# Altium project VM03_hv6.PrjPcb (part 1 of 2)
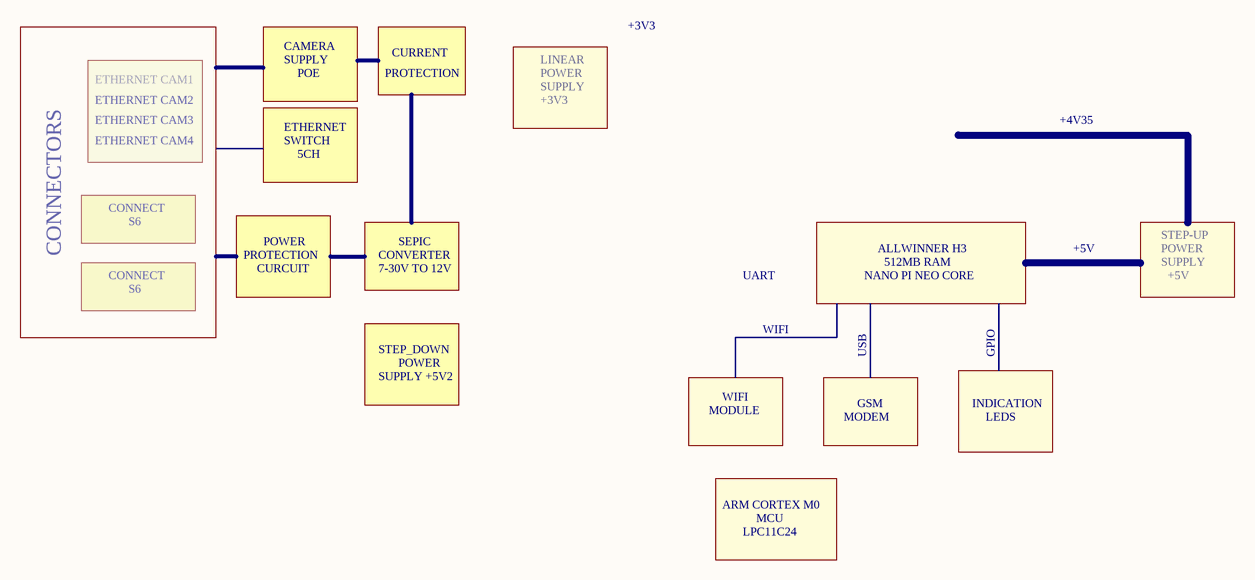
[diagram p0: [2]-BLOCK_DIAGRAM.SchDoc]
19 sheets, 346 parts. Net scope: flat (ports and power ports of the same name join across sheets).
Board file: VM03_hv6.PcbDoc
Sheets:
  [2]-BLOCK_DIAGRAM.SchDoc
  [3]-MCU_MAIN.SchDoc
  [4]-MCU_POWER.SchDoc
  [5]-MCU_CONNECTORS.SchDoc
  [6]-H3_MAIN.SchDoc
  [7]-H3_POWER.SchDoc
  [8]-MODEM_MAIN.SchDoc
  [9]-MODEM_POWER.SchDoc
  [10]-MODEM_CONNECTORS.SchDoc
  [11]-MAIN_POWER.SchDoc
  [12]-CAMERA_POWER.SchDoc
  [13]-BACKUP_POWER.SchDoc
  [14]-CURRENT_METER.SchDoc
  [15]-CLOCK.SchDoc
  [16]-ETH_SWITCH.SchDoc
  [17]-ETH_CONNECTOR.SchDoc
  [18]-WIFI_MODULE.SchDoc
  [19]-CAMERA_PWR_CONNECTORS.SchDoc
  [20]-CONNECT_CONNECTORS.SchDoc

## Sheet [2]-BLOCK_DIAGRAM.SchDoc
size A4

### Notes on the sheet
- CAMERA
- SUPPLY
- CURRENT
- LINEAR
- +3V3
- ETHERNET CAM1
- ETHERNET CAM2
- ETHERNET CAM3
- POE
- PROTECTION
- POWER
- +4V35
- ETHERNET CAM4
- ETHERNET
- SWITCH
- 5CH
- CONNECTORS
- CONNECT
- S6
- CONVERTER
- SEPIC
- ALLWINNER H3
- +5V
- STEP-UP
- CURCUIT
- 7-30V TO 12V
- UART
- WIFI
- NANO PI NEO CORE
- 512MB RAM
- SUPPLY +5V2
- STEP_DOWN
- USB
- GPIO
- MODULE
- MODEM
- GSM
- INDICATION
- LEDS
- ARM CORTEX M0
- MCU
- LPC11C24

## Sheet [3]-MCU_MAIN.SchDoc
size A4
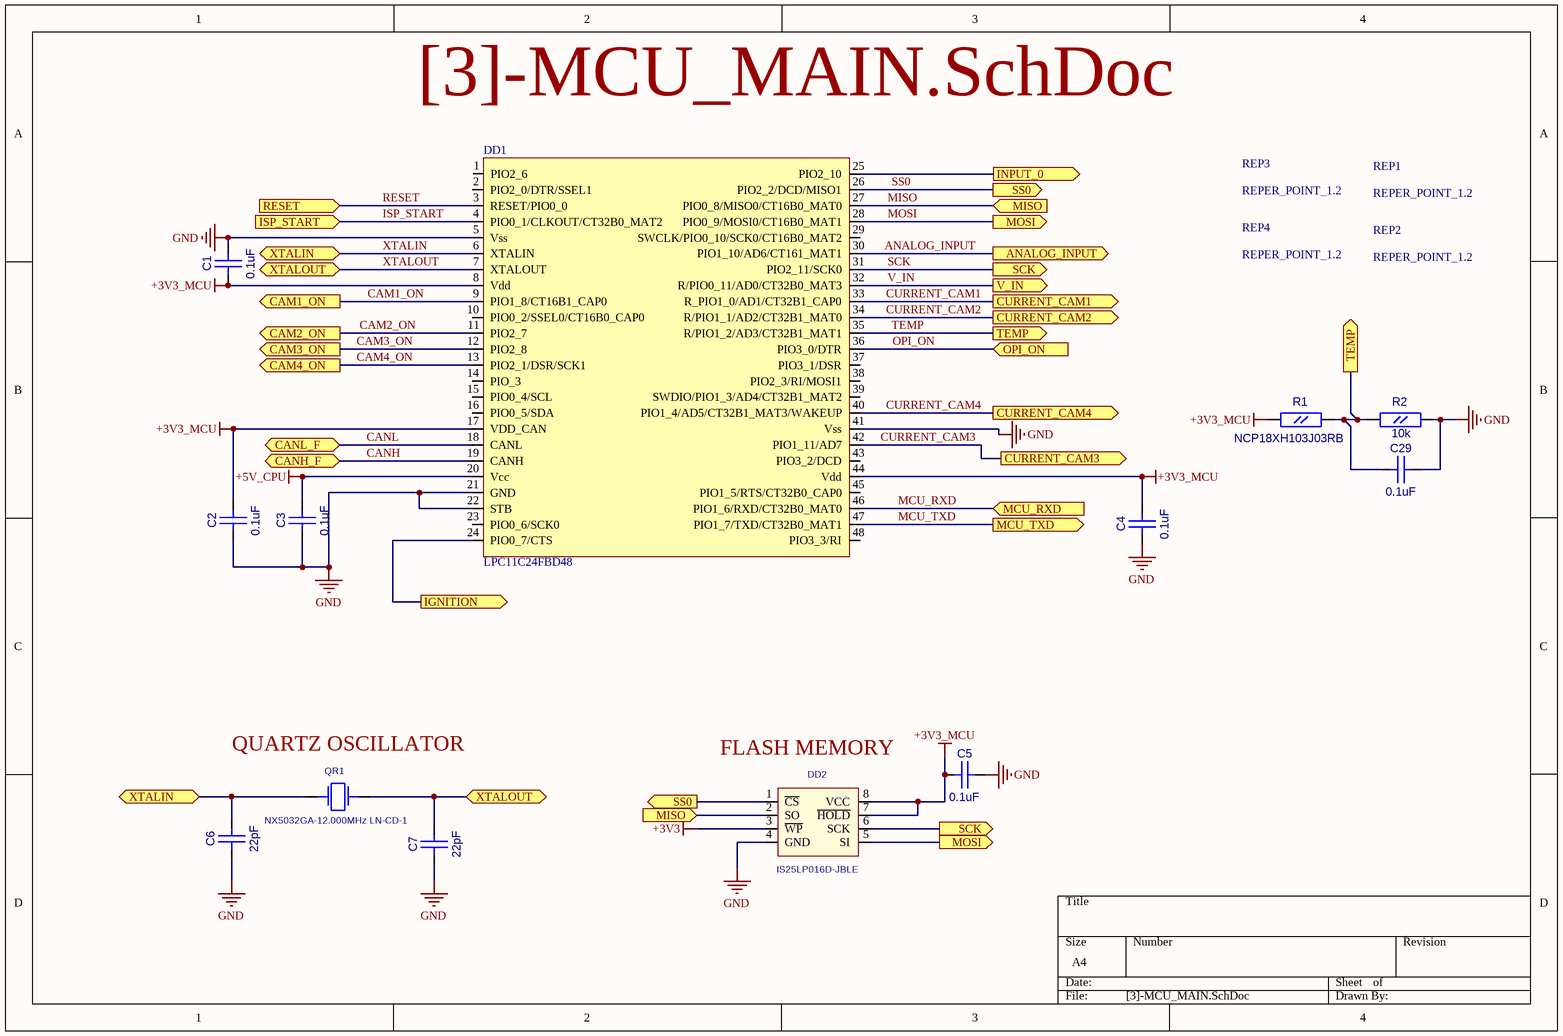
[diagram p1: [3]-MCU_MAIN.SchDoc]

### Parts
C1  0.1uF  [CC0603]
C2  0.1uF  [CC0603]
C3  0.1uF  [CC0603]
C4  0.1uF  [CC0603]
C5  0.1uF  [CC0603]
C6  22pF  [CC0603]
C7  22pF  [CC0603]
C29  0.1uF  [CC0603]
DD1  LPC11C24FBD48  [LQFP48]
DD2  IS25LP016D-JBLE  [EIAJ_SO8]
QR1  NX5032GA-12.000MHz LN-CD-1  [AC5032_2]
R1  NCP18XH103J03RB  [RC0603]
R2  10k  [RC0603]
REP1  REPER_POINT_1.2  [REPER1.2]
REP2  REPER_POINT_1.2  [REPER1.2]
REP3  REPER_POINT_1.2  [REPER1.2]
REP4  REPER_POINT_1.2  [REPER1.2]

### Ports
ANALOG_INPUT (out), CAM1_ON (out), CAM2_ON (out), CAM3_ON (out), CAM4_ON (out), CANH_F (bidir), CANL_F (bidir), CURRENT_CAM1 (out), CURRENT_CAM2 (out), CURRENT_CAM3 (out), CURRENT_CAM4 (out), IGNITION (out), INPUT_0 (out), ISP_START (in), MCU_RXD (in), MCU_TXD (out), MISO (in), MOSI (out), OPI_ON (in), RESET (in), SCK (out), SS0 (out), TEMP (out), V_IN (out), XTALIN (bidir), XTALOUT (bidir)

### Nets
+3V3: DD2.3(~{WP})
+3V3_MCU: C1.1(A) C2.2(B) C4.2(B) C5.1(A) DD1.8(Vdd) DD1.17(VDD_CAN) DD1.44(Vdd) DD2.7(~{HOLD}) DD2.8(VCC) R1.1(A)
+5V_CPU: C3.2(B) DD1.20(Vcc)  [project net VUSB]
GND: C1.2(B) C2.1(A) C3.1(A) C4.1(A) C5.2(B) C6.1(A) C7.1(A) C29.2(B) DD1.5(Vss) DD1.21(GND) DD1.22(STB) DD1.41(Vss) DD2.4(GND) R2.2(B)
ANALOG_INPUT: DD1.30(PIO1_10/AD6/CT161_MAT1) ; port ANALOG_INPUT
CAM1_ON: DD1.9(PIO1_8/CT16B1_CAP0) ; port CAM1_ON
CAM2_ON: DD1.11(PIO2_7) ; port CAM2_ON
CAM3_ON: DD1.12(PIO2_8) ; port CAM3_ON
CAM4_ON: DD1.13(PIO2_1/DSR/SCK1) ; port CAM4_ON
CANH: DD1.19(CANH) ; port CANH_F
CANL: DD1.18(CANL) ; port CANL_F
CURRENT_CAM1: DD1.33(R_PIO1_0/AD1/CT32B1_CAP0) ; port CURRENT_CAM1
CURRENT_CAM2: DD1.34(R/PIO1_1/AD2/CT32B1_MAT0) ; port CURRENT_CAM2
CURRENT_CAM3: DD1.42(PIO1_11/AD7) ; port CURRENT_CAM3
CURRENT_CAM4: DD1.40(PIO1_4/AD5/CT32B1_MAT3/WAKEUP) ; port CURRENT_CAM4
INPUT_0: DD1.25(PIO2_10) ; port INPUT_0
ISP_START: DD1.4(PIO0_1/CLKOUT/CT32B0_MAT2) ; port ISP_START
MCU_RXD: DD1.46(PIO1_6/RXD/CT32B0_MAT0) ; port MCU_RXD
MCU_TXD: DD1.47(PIO1_7/TXD/CT32B0_MAT1) ; port MCU_TXD
MISO: DD1.27(PIO0_8/MISO0/CT16B0_MAT0) DD2.2(SO) ; port MISO
MOSI: DD1.28(PIO0_9/MOSI0/CT16B0_MAT1) DD2.5(SI) ; port MOSI
OPI_ON: DD1.36(PIO3_0/DTR) ; port OPI_ON
RESET: DD1.3(RESET/PIO0_0) ; port RESET
SCK: DD1.31(PIO2_11/SCK0) DD2.6(SCK) ; port SCK
SS0: DD1.26(PIO2_2/DCD/MISO1) DD2.1(~{CS}) ; port SS0
TEMP: C29.1(A) DD1.35(R/PIO1_2/AD3/CT32B1_MAT1) R1.2(B) R2.1(A) ; port TEMP
V_IN: DD1.32(R/PIO0_11/AD0/CT32B0_MAT3) ; port V_IN
XTALIN: C6.2(B) DD1.6(XTALIN) QR1.1 ; port XTALIN
XTALOUT: C7.2(B) DD1.7(XTALOUT) QR1.2 ; port XTALOUT
NetC118_2: DD1.24(PIO0_7/CTS) ; port IGNITION

Not connected (* = marked no-connect by the designer): DD1 1(PIO2_6) 2(PIO2_0/DTR/SSEL1) 10(PIO0_2/SSEL0/CT16B0_CAP0) 14(PIO_3) 15(PIO0_4/SCL) 16(PIO0_5/SDA) 23(PIO0_6/SCK0) 29(SWCLK/PIO0_10/SCK0/CT16B0_MAT2) 37(PIO3_1/DSR) 38(PIO2_3/RI/MOSI1) 39(SWDIO/PIO1_3/AD4/CT32B1_MAT2) 43(PIO3_2/DCD) 45(PIO1_5/RTS/CT32B0_CAP0) 48(PIO3_3/RI); REP1 1; REP2 1; REP3 1; REP4 1

### Notes on the sheet
- (near QR1) QUARTZ OSCILLATOR
- (near DD2) FLASH MEMORY

### Library data of the parts
C1-C7 C29 = CC0603
  C1-C5 C29: Value: 0.1uF
  C6 C7: Value: 22pF
DD2 = S25FL016A0LMFI01: Value: IS25LP016D-JBLE
QR1 = AC5032_2: AC5032/2; Value: NX5032GA-12.000MHz LN-CD-1
R1 R2 = RC0603
  R1: Value: NCP18XH103J03RB
  R2: Value: 10k
REP1-REP4 = REPER1.2: Value: REPER_POINT_1.2
DD1 = LPC11C24FBD48: Value: LPC11C24FBD48

## Sheet [4]-MCU_POWER.SchDoc
size A4
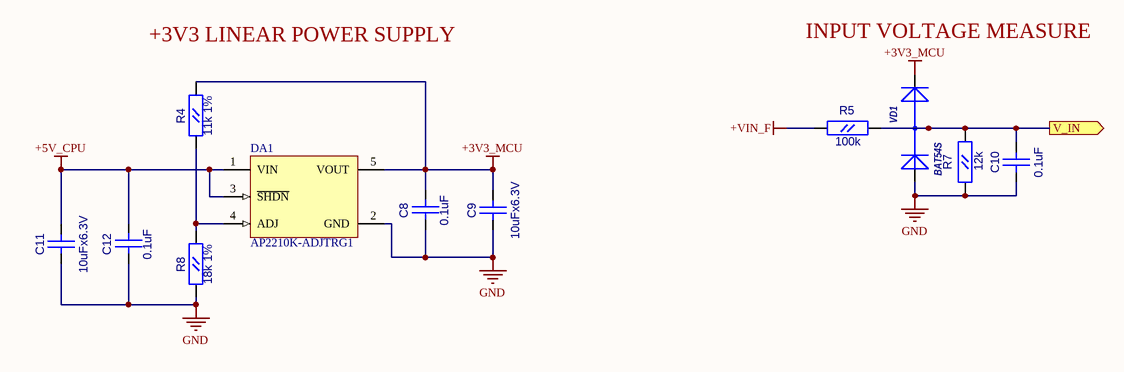
[diagram p2: [4]-MCU_POWER.SchDoc]

### Parts
C8  0.1uF  [CC0603]
C9  10uFx6.3V  [CC0805]
C10  0.1uF  [CC0603]
C11  10uFx6.3V  [CC0805]
C12  0.1uF  [CC0603]
DA1  AP2210K-ADJTRG1  [SOT23-5]
R4  11k 1%  [RC0603]
R5  100k  [RC0603]
R7  12k  [RC0603]
R8  18k 1%  [RC0603]
VD1  BAT54S  [SOT-23(GSD)]

### Ports
V_IN (out)

### Nets
+3V3_MCU: C8.1(A) C9.2(B) DA1.5(VOUT) R4.2(B) VD1.2(K)
+5V_CPU: C11.2(B) C12.1(A) DA1.1(VIN) DA1.3(~{SHDN})  [project net VUSB]
+VIN_F: R5.1(A)
GND: C8.2(B) C9.1(A) C10.1(A) C11.1(A) C12.2(B) DA1.2(GND) R7.1(A) R8.1(A) VD1.1(A)
V_IN: C10.2(B) R5.2(B) R7.2(B) VD1.3(AK) ; port V_IN
NetDA1_4: DA1.4(ADJ) R4.1(A) R8.2(B)

### Notes on the sheet
- (near R4) +3V3 LINEAR POWER SUPPLY
- (near VD1) INPUT VOLTAGE MEASURE

### Library data of the parts
C8 C10 C12 = CC0603: Value: 0.1uF
C9 C11 = CC0805: Value: 10uFx6.3V
DA1 = MCP1824T-ADJE/OT: 300 mA, Low Voltage, Low Quiescent Current LDO Regulator, 5-Pin SOT-223, Extended Temperature, Tape and Reel; Published: 29-Jan-2009; DatasheetVersion: revA, Aug-2007; PackageVersion: revAW, Oct-2008; PackageReference: SOT-223-DC5; Publisher: Altium Limited; PackageDescription: 5-Lead Plastic Small Outline Transistor (DC) [SOT-223]; ComponentLink1Description: Manufacturer Link; ComponentLink1URL: http://www.microchip.com; ComponentLink2Description: Datasheet; ComponentLink2URL: http://ww1.microchip.com/downloads/en/DeviceDoc/22070a.pdf; ComponentLink3Description: Packaging Specification; ComponentLink3URL: http://ww1.microchip.com/downloads/en/PackagingSpec/00049AW.pdf
R4 R5 R7 R8 = RC0603
  R4: Value: 11k 1%
  R5: Value: 100k
  R7: Value: 12k
  R8: Value: 18k 1%
VD1 = BAT54S: 1.0 Ampere General Purpose Rectifier; ComponentField6: Published 8-Jun-2000, Modified 11-July-2000: SIM Model Added.; Value: *

## Sheet [5]-MCU_CONNECTORS.SchDoc
size A4
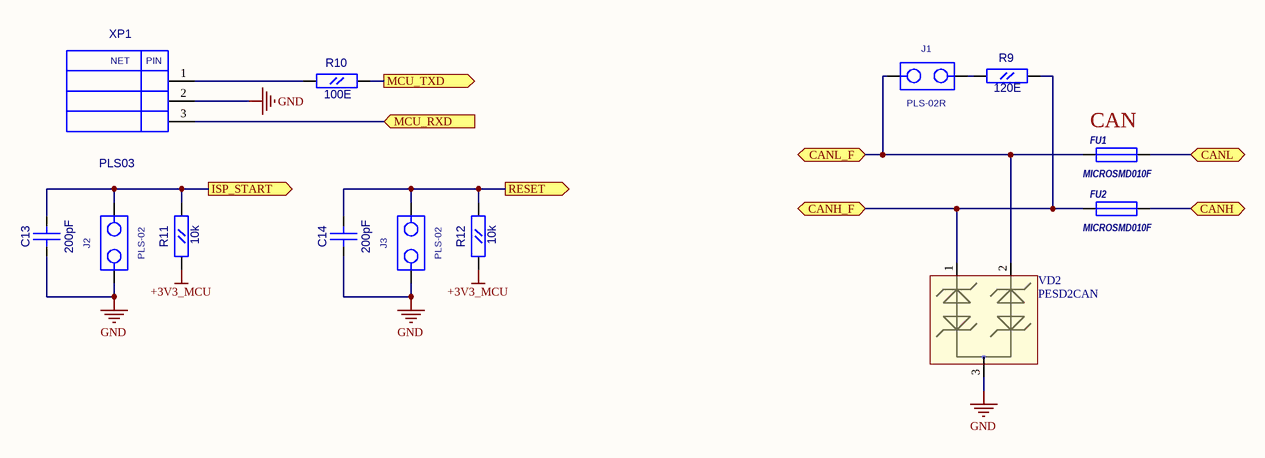
[diagram p3: [5]-MCU_CONNECTORS.SchDoc]

### Parts
C13  200pF  [CC0603]
C14  200pF  [CC0603]
FU1  MICROSMD010F  [RC1210]
FU2  MICROSMD010F  [RC1210]
J1  PLS-02R  [PLS-02R]
J2  PLS-02  [PLS-02]
J3  PLS-02  [PLS-02]
R9  120E  [RC0805]
R10  100E  [RC0603]
R11  10k  [RC0603]
R12  10k  [RC0603]
VD2  PESD2CAN  [SOT-23(123)]
XP1  PLS03  [PLS-03]

### Ports
CANH (bidir), CANH_F (bidir), CANL (bidir), CANL_F (bidir), ISP_START (out), MCU_RXD (in), MCU_TXD (out), RESET (out)

### Nets
+3V3_MCU: R11.1(A) R12.1(A)
GND: C13.1(A) C14.1(A) J2.1 J3.1 VD2.3 XP1.2
CANH: FU2.1 R9.2(B) VD2.1 ; port CANH_F
CANL: FU1.1 J1.1 VD2.2 ; port CANL_F
ISP_START: C13.2(B) J2.2 R11.2(B) ; port ISP_START
MCU_RXD: XP1.3 ; port MCU_RXD
MCU_TXD: R10.2(B) ; port MCU_TXD
RESET: C14.2(B) J3.2 R12.2(B) ; port RESET
NetFU1_2: FU1.2 ; port CANL
NetFU2_2: FU2.2 ; port CANH
NetJ1_2: J1.2 R9.1(A)
NetR10_1: R10.1(A) XP1.1

### Notes on the sheet
- (near FU1) CAN
- (in symbol PLS03) NET; PIN

### Library data of the parts
C13 C14 = CC0603: Value: 200pF
FU1 FU2 = MICROSMD: Value: *
R9 = RC0805: Value: 120E
R10-R12 = RC0603
  R10: Value: 100E
  R11 R12: Value: 10k
VD2 = PESD2CAN: TVS for CAN
J1 = PLS-02R: Value: *
J2 J3 = PLS-02: Value: *
XP1 = PLS03: Value: *

## Sheet [6]-H3_MAIN.SchDoc
size A4
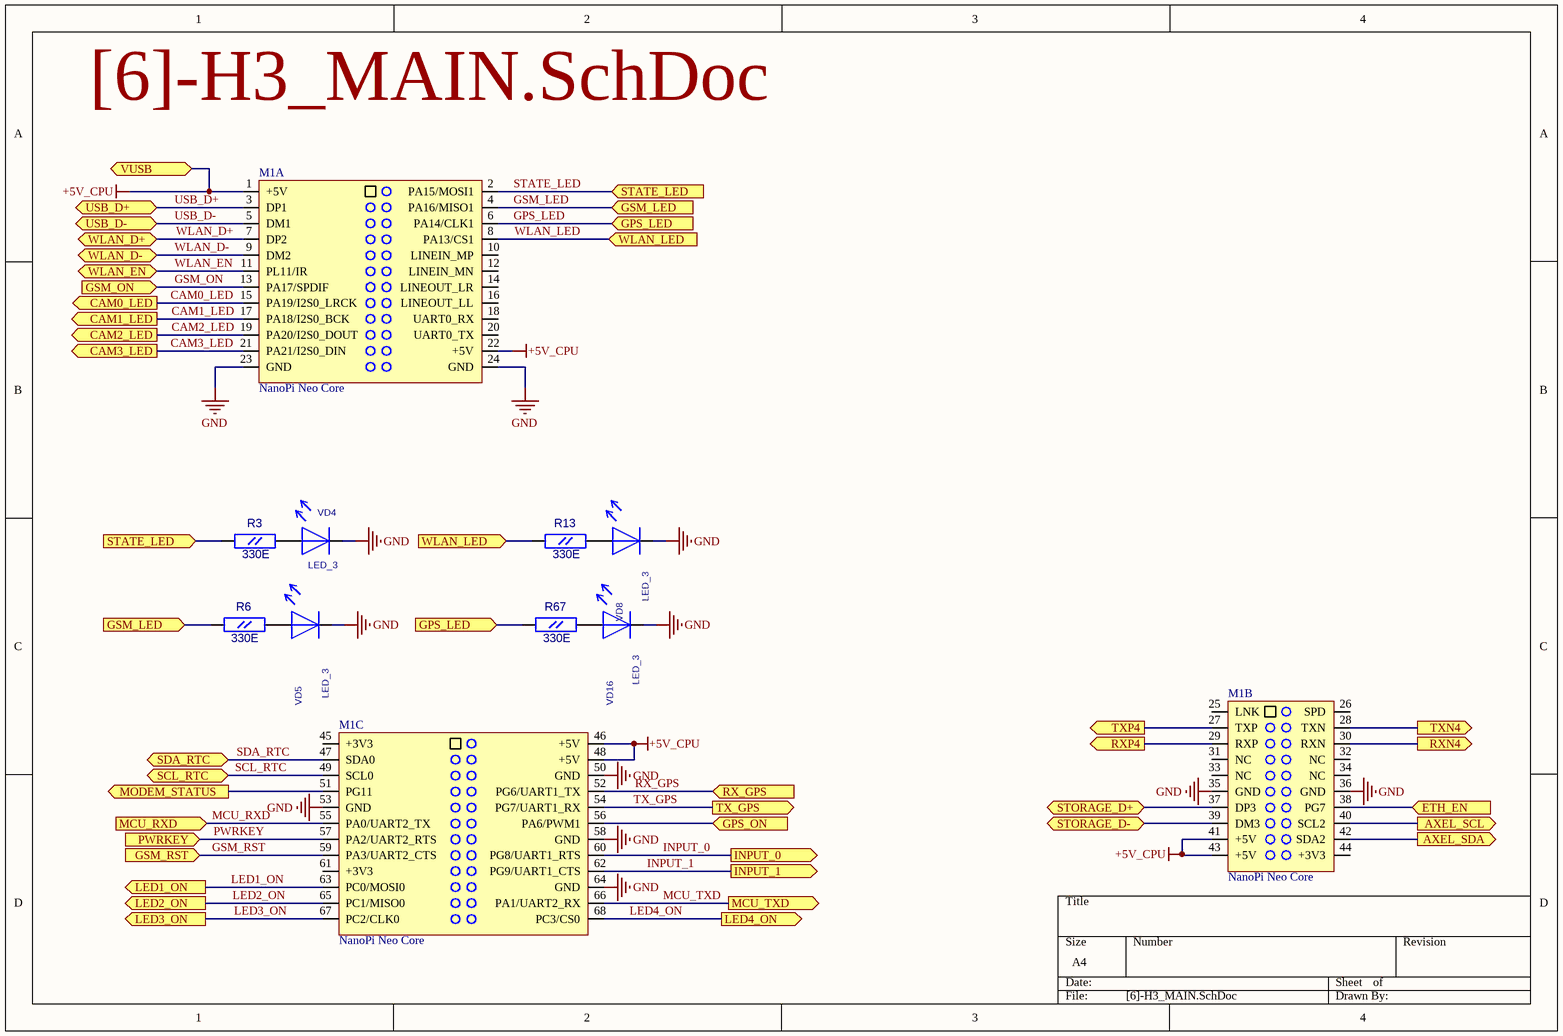
[diagram p4: [6]-H3_MAIN.SchDoc]

### Parts
M1  NanoPi Neo Core  [NanoPiNeo_CORE]  (parts A,B,C of 3)
R3  330E  [RC0603]
R6  330E  [RC0603]
R13  330E  [RC0603]
R67  330E  [RC0603]
VD4  LED_3  [LED3]
VD5  LED_3  [LED3]
VD8  LED_3  [LED3]
VD16  LED_3  [LED3]

### Ports
AXEL_SCL (out), AXEL_SDA (out), CAM0_LED (out), CAM1_LED (out), CAM2_LED (out), CAM3_LED (out), ETH_EN (in), GPS_LED (in), GPS_ON (in), GSM_LED (in), GSM_ON (in), GSM_RST (in), INPUT_0 (out), INPUT_1 (out), LED1_ON (out), LED2_ON (out), LED3_ON (out), LED4_ON (out), MCU_RXD (in), MCU_TXD (out), MODEM_STATUS (out), PWRKEY (in), RX_GPS (in), RXN4 (out), RXP4 (out), SCL_RTC (bidir), SDA_RTC (bidir), STATE_LED (in), STORAGE_D+ (bidir), STORAGE_D- (bidir), TX_GPS (out), TXN4 (out), TXP4 (out), USB_D+ (bidir), USB_D- (bidir), VUSB (bidir), WLAN_D+ (bidir), WLAN_D- (bidir), WLAN_EN (bidir), WLAN_LED (in)

### Nets
+5V_CPU: M1.1(+5V) M1.22(+5V) M1.41(+5V) M1.43(+5V) M1.46(+5V) M1.48(+5V) ; port VUSB  [project net VUSB]
GND: M1.23(GND) M1.24(GND) M1.35(GND) M1.36(GND) M1.50(GND) M1.53(GND) M1.58(GND) M1.64(GND) VD4.1 VD5.1 VD8.1 VD16.1
CAM0_LED: M1.15(PA19/I2S0_LRCK) ; port CAM0_LED
CAM1_LED: M1.17(PA18/I2S0_BCK) ; port CAM1_LED
CAM2_LED: M1.19(PA20/I2S0_DOUT) ; port CAM2_LED
CAM3_LED: M1.21(PA21/I2S0_DIN) ; port CAM3_LED
GPS_LED: M1.6(PA14/CLK1) R67.1(A) ; port GPS_LED
GSM_LED: M1.4(PA16/MISO1) R6.1(A) ; port GSM_LED
GSM_ON: M1.13(PA17/SPDIF) ; port GSM_ON
GSM_RST: M1.59(PA3/UART2_CTS) ; port GSM_RST
INPUT_0: M1.60(PG8/UART1_RTS) ; port INPUT_0
INPUT_1: M1.62(PG9/UART1_CTS) ; port INPUT_1
LED1_ON: M1.63(PC0/MOSI0) ; port LED1_ON
LED2_ON: M1.65(PC1/MISO0) ; port LED2_ON
LED3_ON: M1.67(PC2/CLK0) ; port LED3_ON
LED4_ON: M1.68(PC3/CS0) ; port LED4_ON
MCU_RXD: M1.55(PA0/UART2_TX) ; port MCU_RXD
MCU_TXD: M1.66(PA1/UART2_RX) ; port MCU_TXD
MODEM_STATUS: M1.51(PG11) ; port MODEM_STATUS
PWRKEY: M1.57(PA2/UART2_RTS) ; port PWRKEY
RX_GPS: M1.52(PG6/UART1_TX) ; port RX_GPS
SCL_RTC: M1.49(SCL0) ; port SCL_RTC
SDA_RTC: M1.47(SDA0) ; port SDA_RTC
STATE_LED: M1.2(PA15/MOSI1) R3.1(A) ; port STATE_LED
TX_GPS: M1.54(PG7/UART1_RX) ; port TX_GPS
USB_D+: M1.3(DP1) ; port USB_D+
USB_D-: M1.5(DM1) ; port USB_D-
WLAN_D+: M1.7(DP2) ; port WLAN_D+
WLAN_D-: M1.9(DM2) ; port WLAN_D-
WLAN_EN: M1.11(PL11/IR) ; port WLAN_EN
WLAN_LED: M1.8(PA13/CS1) R13.1(A) ; port WLAN_LED
NetDA8_3: M1.38(PG7) ; port ETH_EN
NetDD4_19: M1.27(TXP) ; port TXP4
NetDD4_20: M1.28(TXN) ; port TXN4
NetDD4_21: M1.30(RXN) ; port RXN4
NetDD4_22: M1.29(RXP) ; port RXP4
NetM1_37: M1.37(DP3) ; port STORAGE_D+
NetM1_39: M1.39(DM3) ; port STORAGE_D-
NetM1_40: M1.40(SCL2) ; port AXEL_SCL
NetM1_42: M1.42(SDA2) ; port AXEL_SDA
NetM1_56: M1.56(PA6/PWM1) ; port GPS_ON
NetR3_2: R3.2(B) VD4.2
NetR6_2: R6.2(B) VD5.2
NetR13_2: R13.2(B) VD8.2
NetR67_2: R67.2(B) VD16.2

Not connected (* = marked no-connect by the designer): M1 10(LINEIN_MP) 12(LINEIN_MN) 14(LINEOUT_LR) 16(LINEOUT_LL) 18(UART0_RX) 20(UART0_TX) 25(LNK) 26(SPD) 31(NC) 32(NC) 33(NC) 34(NC) 44(+3V3) 45(+3V3) 61(+3V3)

### Library data of the parts
M1 = NanoPi Neo Core: Nano Pi Neo Core Allwinner H3 based embedded module; Value: NanoPi Neo Core
R3 R6 R13 R67 = RC0603: Value: 330E
VD4 VD5 VD8 VD16 = LED_3: Value: *

## Sheet [7]-H3_POWER.SchDoc
size A4
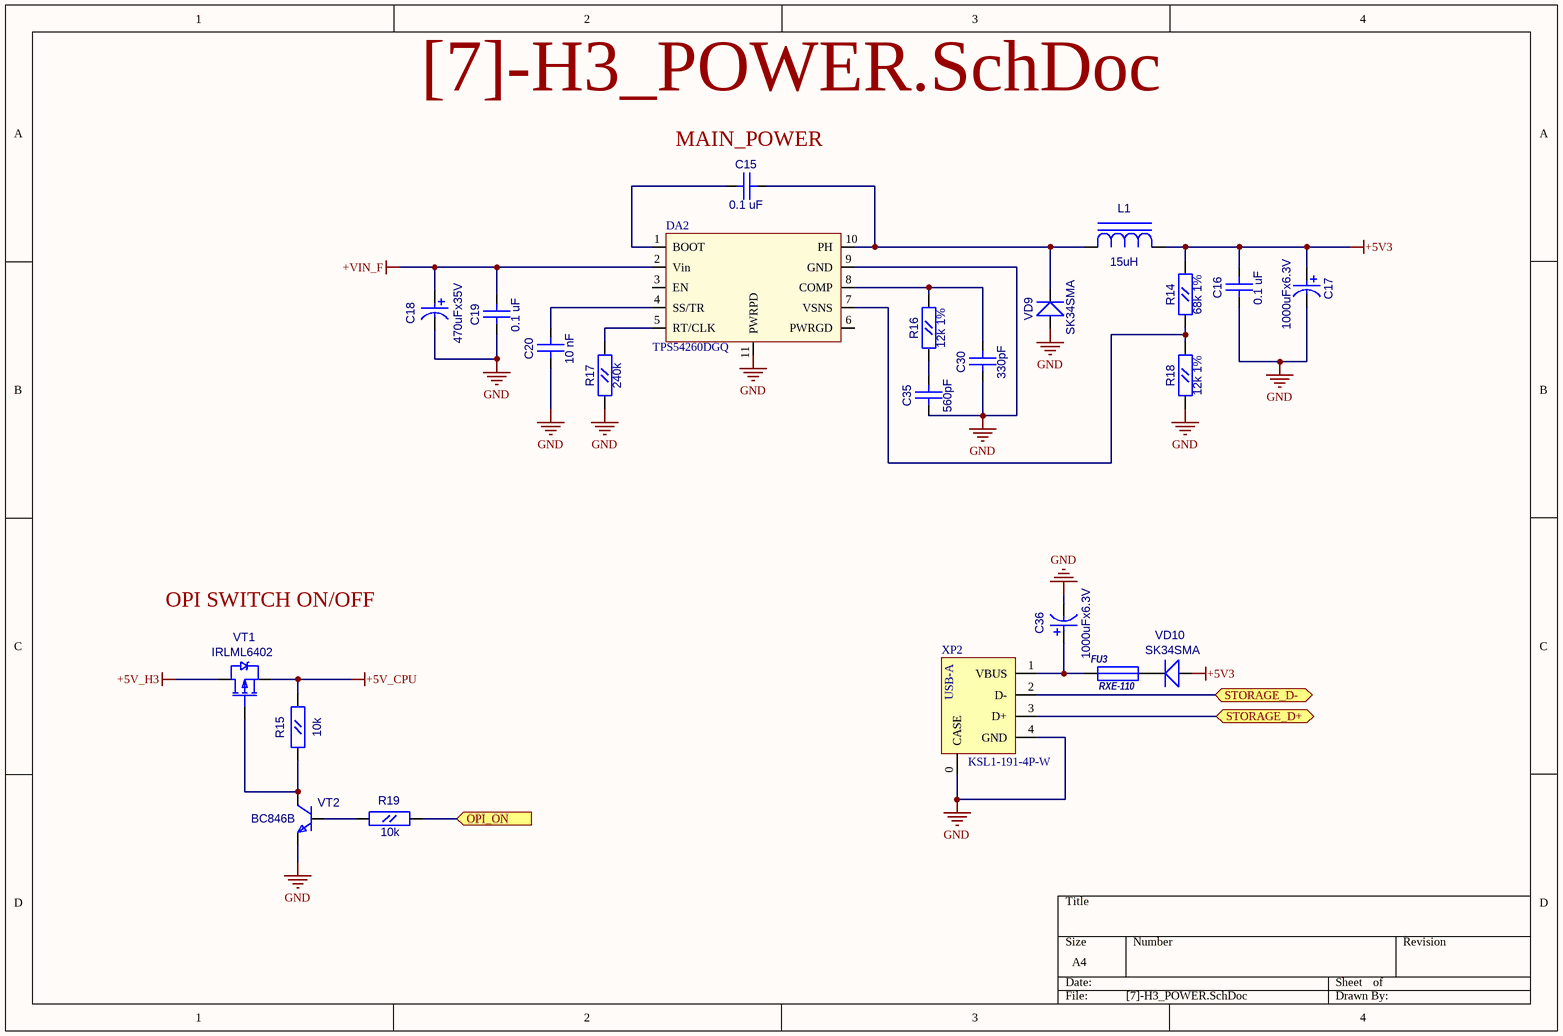
[diagram p5: [7]-H3_POWER.SchDoc]

### Parts
C15  0.1 uF  [CC0603]
C16  0.1 uF  [CC0603]
C17  1000uFx6.3V  [CC8X3.5]
C18  470uFx35V  [CC16X10_CAP0.5(1)(Primary)]
C19  0.1 uF  [CC0603]
C20  10 nF  [CC0603]
C30  330pF  [CC0603]
C35  560pF  [CC0603]
C36  value 1000uFx6.3V  [CC8X3.5]  (hidden comment: CAP0.35)
DA2  TPS54260DGQ  [S-PDSO-G10]
FU3  RXE-110  [RXE-110]
L1  15uH  [SDR0805]
R14  68k 1%  [RC0603]
R15  10k  [RC0603]
R16  12k 1%  [RC0603]
R17  240k  [RC0603]
R18  12k 1%  [RC0603]
R19  10k  [RC0603]
VD9  SK34SMA  [SMA]
VD10  SK34SMA  [SMA]
VT1  IRLML6402  [SOT-23(123)]
VT2  BC846B  [SOT-23(123)]
XP2  KSL1-191-4P-W  [USB_A_REAR]

### Ports
OPI_ON (in), STORAGE_D+ (bidir), STORAGE_D- (bidir)

### Nets
+5V3: C16.1(A) C17.1 L1.2(A) R14.2(B) VD10.1(A)
+5V_CPU: R15.2(B) VT1.2(S)  [project net VUSB]
+5V_H3: VT1.3(D)
+VIN_F: C18.2 C19.1(A) DA2.2(Vin)
GND: C16.2(B) C17.2 C18.1 C19.2(B) C20.2(B) C30.2(B) C35.2(B) C36.2 DA2.9(GND) DA2.11(PWRPD) R17.1(A) R18.1(A) VD9.1(A) VT2.2(E) XP2.0(CASE) XP2.4(GND)
OPI_ON: R19.2(B) ; port OPI_ON
NetC15_1: C15.1(A) DA2.10(PH) L1.1(C) VD9.2(K)
NetC15_2: C15.2(B) DA2.1(BOOT)
NetC20_1: C20.1(A) DA2.4(SS/TR)
NetC30_1: C30.1(A) DA2.8(COMP) R16.2(B)
NetC35_1: C35.1(A) R16.1(A)
NetC36_1: C36.1 FU3.1 XP2.1(VBUS)
NetDA2_5: DA2.5(RT/CLK) R17.2(B)
NetDA2_7: DA2.7(VSNS) R14.1(A) R18.2(B)
NetFU3_2: FU3.2 VD10.2(K)
NetM1_37: XP2.3(D+) ; port STORAGE_D+
NetM1_39: XP2.2(D-) ; port STORAGE_D-
NetR15_1: R15.1(A) VT1.1(G) VT2.3(C)
NetR19_1: R19.1(A) VT2.1(B)

Not connected (* = marked no-connect by the designer): DA2 3(EN) 6(PWRGD)

### Notes on the sheet
- (near C15) MAIN_POWER
- OPI SWITCH ON/OFF
- (in symbol USB_A_REAR) USB-A

### Library data of the parts
C15 C16 C19 C20 C30 C35 = CC0603
  C15 C16 C19: Value: 0.1 uF
  C20: Value: 10 nF
  C30: Value: 330pF
  C35: Value: 560pF
C17 = CAP0.35: Value: 1000uFx6.3V
C18 = CAP0.5(1): Value: 470uFx35V
L1 = SDR0805: Value: 15uH
R14-R19 = RC0603
  R14: Value: 68k 1%
  R15 R19: Value: 10k
  R16 R18: Value: 12k 1%
  R17: Value: 240k
VD9 VD10 = SK34SMA: Schottky Rectifier; Value: {Value}
VT1 = IRLML6402: HEXFET Power MOSFET; OriginalName: IRLML5103; ComponentField7: Published 8-Jun-2000; Value: IRLML6402
VT2 = BC846BLT1: ComponentField7: Published 29-Sep-2000; OriginalName: BC846BLT1; Value: BC846B
XP2 = USB_A_REAR: USB A rear side connector; Value: KSL1-191-4P-W
FU3 = RXE-110: Value: *

## Sheet [8]-MODEM_MAIN.SchDoc
size A4
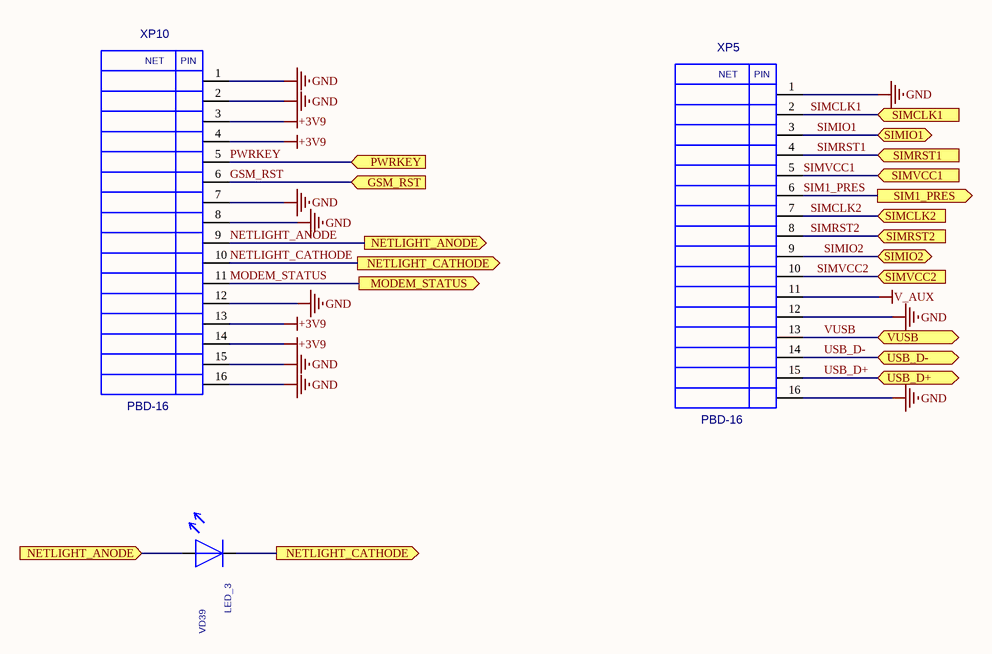
[diagram p6: [8]-MODEM_MAIN.SchDoc]

### Parts
VD39  LED_3  [LED3]
XP5  PBD-16  [PBD16]
XP10  PBD-16  [PBD16]

### Ports
GSM_RST (in), MODEM_STATUS (out), NETLIGHT_ANODE (in), NETLIGHT_ANODE (out), NETLIGHT_CATHODE (out), PWRKEY (in), SIM1_PRES (out), SIMCLK1 (in), SIMCLK2 (in), SIMIO1 (bidir), SIMIO2 (bidir), SIMRST1 (in), SIMRST2 (in), SIMVCC1 (in), SIMVCC2 (in), USB_D+ (bidir), USB_D- (bidir), VUSB (bidir)

### Nets
+3V9: XP10.3 XP10.4 XP10.13 XP10.14
GND: XP5.1 XP5.12 XP5.16 XP10.1 XP10.2 XP10.7 XP10.8 XP10.12 XP10.15 XP10.16
V_AUX: XP5.11
VUSB: XP5.13 ; port VUSB
GSM_RST: XP10.6 ; port GSM_RST
MODEM_STATUS: XP10.11 ; port MODEM_STATUS
NETLIGHT_ANODE: VD39.2 XP10.9 ; port NETLIGHT_ANODE
NETLIGHT_CATHODE: VD39.1 XP10.10 ; port NETLIGHT_CATHODE
PWRKEY: XP10.5 ; port PWRKEY
SIM1_PRES: XP5.6 ; port SIM1_PRES
SIMCLK1: XP5.2 ; port SIMCLK1
SIMCLK2: XP5.7 ; port SIMCLK2
SIMIO1: XP5.3 ; port SIMIO1
SIMIO2: XP5.9 ; port SIMIO2
SIMRST1: XP5.4 ; port SIMRST1
SIMRST2: XP5.8 ; port SIMRST2
SIMVCC1: XP5.5 ; port SIMVCC1
SIMVCC2: XP5.10 ; port SIMVCC2
USB_D+: XP5.15 ; port USB_D+
USB_D-: XP5.14 ; port USB_D-

### Notes on the sheet
- (in symbol PBD-16) NET; PIN

### Library data of the parts
VD39 = LED_3: Value: *
XP5 XP10 = PBD-16: Value: *

## Sheet [9]-MODEM_POWER.SchDoc
size A4
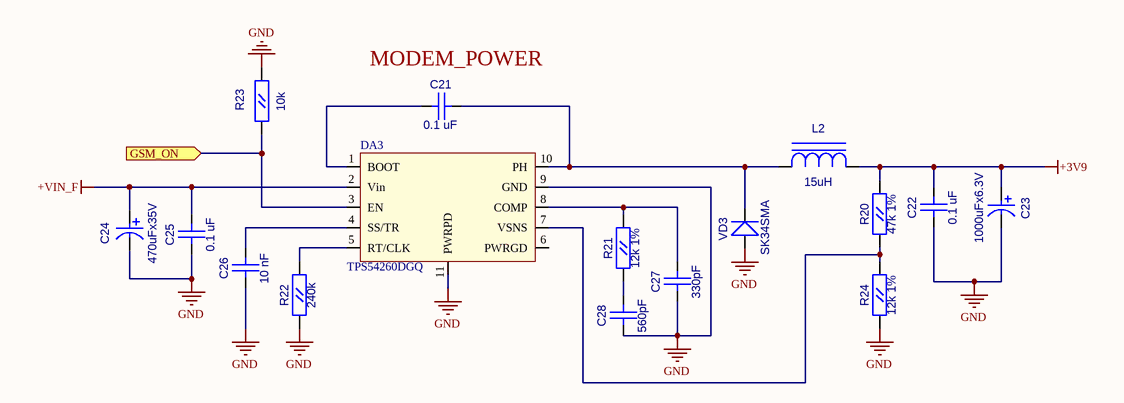
[diagram p7: [9]-MODEM_POWER.SchDoc]

### Parts
C21  0.1 uF  [CC0603]
C22  0.1 uF  [CC0603]
C23  1000uFx6.3V  [CAP_8x14_R]
C24  470uFx35V  [CC16X10_CAP0.5(1)(Primary)]
C25  0.1 uF  [CC0603]
C26  10 nF  [CC0603]
C27  330pF  [CC0603]
C28  560pF  [CC0603]
DA3  TPS54260DGQ  [S-PDSO-G10]
L2  15uH  [SDR0805]
R20  47k 1%  [RC0603]
R21  12k 1%  [RC0603]
R22  240k  [RC0603]
R23  10k  [RC0603]
R24  12k 1%  [RC0603]
VD3  SK34SMA  [SMA]

### Ports
GSM_ON (in)

### Nets
+3V9: C22.1(A) C23.1 L2.2(A) R20.2(B)
+VIN_F: C24.2 C25.1(A) DA3.2(Vin)
GND: C22.2(B) C23.2 C24.1 C25.2(B) C26.2(B) C27.2(B) C28.2(B) DA3.9(GND) DA3.11(PWRPD) R22.1(A) R23.2(B) R24.1(A) VD3.1(A)
GSM_ON: DA3.3(EN) R23.1(A) ; port GSM_ON
NetC21_1: C21.1(A) DA3.10(PH) L2.1(C) VD3.2(K)
NetC21_2: C21.2(B) DA3.1(BOOT)
NetC26_1: C26.1(A) DA3.4(SS/TR)
NetC27_1: C27.1(A) DA3.8(COMP) R21.2(B)
NetC28_1: C28.1(A) R21.1(A)
NetDA3_5: DA3.5(RT/CLK) R22.2(B)
NetDA3_7: DA3.7(VSNS) R20.1(A) R24.2(B)

Not connected (* = marked no-connect by the designer): DA3 6(PWRGD)

### Notes on the sheet
- (near C21) MODEM_POWER

### Library data of the parts
C21 C22 C25-C28 = CC0603
  C21 C22 C25: Value: 0.1 uF
  C26: Value: 10 nF
  C27: Value: 330pF
  C28: Value: 560pF
C23 = CAP_8mm: Radial capacitor; Value: 1000uFx6.3V
C24 = CAP0.5(1): Value: 470uFx35V
L2 = SDR0805: Value: 15uH
R20-R24 = RC0603
  R20: Value: 47k 1%
  R21 R24: Value: 12k 1%
  R22: Value: 240k
  R23: Value: 10k
VD3 = SK34SMA: Schottky Rectifier; Value: {Value}

## Sheet [10]-MODEM_CONNECTORS.SchDoc
size A4
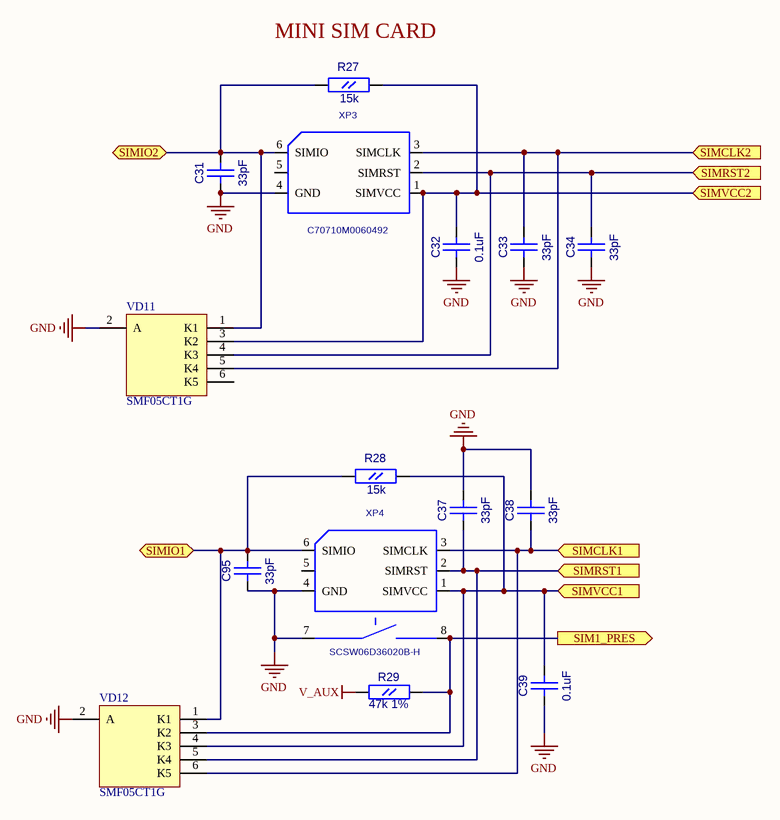
[diagram p8: [10]-MODEM_CONNECTORS.SchDoc]

### Parts
C31  33pF  [CC0603]
C32  0.1uF  [CC0603]
C33  33pF  [CC0603]
C34  33pF  [CC0603]
C37  33pF  [CC0603]
C38  33pF  [CC0603]
C39  0.1uF  [CC0603]
C95  33pF  [CC0603]
R27  15k  [RC0603]
R28  15k  [RC0603]
R29  47k 1%  [RC0603]
VD11  SMF05CT1G  [SOT-363]
VD12  SMF05CT1G  [SOT-363]
XP3  C70710M0060492  [SCVW06A25020]
XP4  SCSW06D36020B-H  [SCSW06D36020B-H]

### Ports
SIM1_PRES (out), SIMCLK1 (in), SIMCLK2 (in), SIMIO1 (bidir), SIMIO2 (bidir), SIMRST1 (in), SIMRST2 (in), SIMVCC1 (in), SIMVCC2 (in)

### Nets
GND: C31.1(A) C32.1(A) C33.1(A) C34.1(A) C37.2(B) C38.2(B) C39.1(A) C95.1(A) VD11.2(A) VD12.2(A) XP3.4(GND) XP4.4(GND) XP4.7
V_AUX: R29.1(A)
SIM1_PRES: R29.2(B) VD12.3(K2) XP4.8 ; port SIM1_PRES
SIMCLK1: C38.1(A) VD12.6(K5) XP4.3(SIMCLK) ; port SIMCLK1
SIMCLK2: C33.2(B) VD11.5(K4) XP3.3(SIMCLK) ; port SIMCLK2
SIMIO1: C95.2(B) R28.1(A) VD12.1(K1) XP4.6(SIMIO) ; port SIMIO1
SIMIO2: C31.2(B) R27.1(A) VD11.1(K1) XP3.6(SIMIO) ; port SIMIO2
SIMRST1: C37.1(A) VD12.5(K4) XP4.2(SIMRST) ; port SIMRST1
SIMRST2: C34.2(B) VD11.4(K3) XP3.2(SIMRST) ; port SIMRST2
SIMVCC1: C39.2(B) R28.2(B) VD12.4(K3) XP4.1(SIMVCC) ; port SIMVCC1
SIMVCC2: C32.2(B) R27.2(B) VD11.3(K2) XP3.1(SIMVCC) ; port SIMVCC2

Not connected (* = marked no-connect by the designer): VD11 6(K5); XP3 5; XP4 5

### Notes on the sheet
- (near R27) MINI SIM CARD

### Library data of the parts
C31-C34 C37-C39 C95 = CC0603
  C31 C33 C34 C37 C38 C95: Value: 33pF
  C32 C39: Value: 0.1uF
R27-R29 = RC0603
  R27 R28: Value: 15k
  R29: Value: 47k 1%
VD11 VD12 = SMF05CT1G: 5-Line Transient Voltage Suppressor Array, 6-Pin SC70, Pb-Free, Tape and Reel; Manufacturer: On Semiconductor; Direction: Unidirectional; IR Max (uA): 5; PPK Max (W): 100; DatasheetVersion: Rev. 4; PackageVersion: Rev. W; PackageReference: SC70-6-419B-02_W; PackageDescription: 6-Pin Small Outline Transistor, Body 2 x 1.25 mm, Pitch 0.65 mm; Supplier 1: Digi-Key; Supplier Part Number 1: SMF05CT1GOSTR-ND; Supplier 2: Digi-Key; Supplier Part Number 2: SMF05CT1GOSCT-ND; Supplier 3: Digi-Key; Supplier Part Number 3: SMF05CT1GOSDKR-ND; Supplier 4: Farnell; Supplier Part Number 4: 1861239; Supplier 5: Newark; Supplier Part Number 5: 10M5715; Supplier 6: Newark; Supplier Part Number 6: 42K2614; Supplier 7: Mouser; Supplier Part Number 7: 863-SMF05CT1G; Packing: Tape and Reel; RoHS: Pb-Free; Mounting Technology: Surface Mount; PartNumber: SMF05CT1G; ComponentLink2Description: Datasheet
XP3 = SCV-W06A25-020: Value: *
XP4 = SCSW06D36020B-H: Value: *

## Sheet [11]-MAIN_POWER.SchDoc
size A4
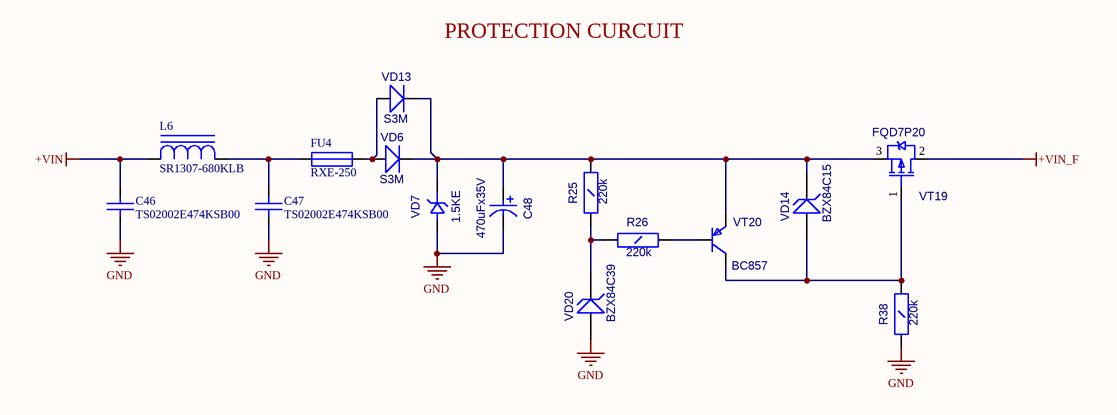
[diagram p9: [11]-MAIN_POWER.SchDoc]

### Parts
C46  TS02002E474KSB00  [CAP_ML_18x7x13]
C47  TS02002E474KSB00  [CAP_ML_18x7x13]
C48  470uFx35V  [CAP10x16_FLAT]
FU4  RXE-250  [RXE-250_FLAT]
L6  SR1307-680KLB  [SR1307]
R25  220k  [RC1206]
R26  220k  [RC1206]
R38  220k  [RC1206]
VD6  S3M  [SMC]
VD7  1.5KE  [DO-201]
VD13  S3M  [SMC]
VD14  BZX84C15  [SOT-23(123)]
VD20  BZX84C39  [SOT-23(123)]
VT19  FQD7P20  [D-PAK(TO-252AA)]
VT20  BC857  [SOT-23(123)]

### Nets
+VIN: C46.2(B) L6.1(C)
+VIN_F: VT19.2(D)
GND: C46.1(A) C47.1(A) C48.1 R38.1(A) VD7.1(A) VD20.1(A)
NetC47_2: C47.2(B) FU4.1 L6.2(A)
NetC48_2: C48.2 R25.2(B) VD6.2(K) VD7.2(K) VD13.2(K) VD14.3(K) VT19.3(S) VT20.2(E)
NetFU4_2: FU4.2 VD6.1(A) VD13.1(A)
NetR25_1: R25.1(A) R26.1(A) VD20.3(K)
NetR26_2: R26.2(B) VT20.1(B)
NetR38_2: R38.2(B) VD14.1(A) VT19.1(G) VT20.3(C)

### Notes on the sheet
- PROTECTION CURCUIT

### Library data of the parts
C46 C47 = CAP_HV_18x7x13: Value: TS02002E474KSB00
C48 = CAP_10mm: Radial capacitor; Value: 470uFx35V
L6 = SR1307: Power inductor; Value: SR1307-680KLB
R25 R26 R38 = RC1206: Value: 220k
VD6 VD13 = S3A: Schottky Rectifier; Value: S3M
VD14 VD20 = BZX84: Zener Voltage Regulator Diode
  VD14: Value: BZX84C15
  VD20: Value: BZX84C39
VT19 = IRFR9220: HEXFET Power MOSFET; OriginalName: IRLML5103; ComponentField7: Published 8-Jun-2000; Value: FQD7P20
VT20 = BC857B: PNP 100ma transistor; OriginalName: BC846BLT1; ComponentField7: Published 29-Sep-2000; Value: BC857
FU4 = RXE-250: Value: RXE-250
VD7 = 1.5KE: Value: *

## Sheet [12]-CAMERA_POWER.SchDoc
size A4
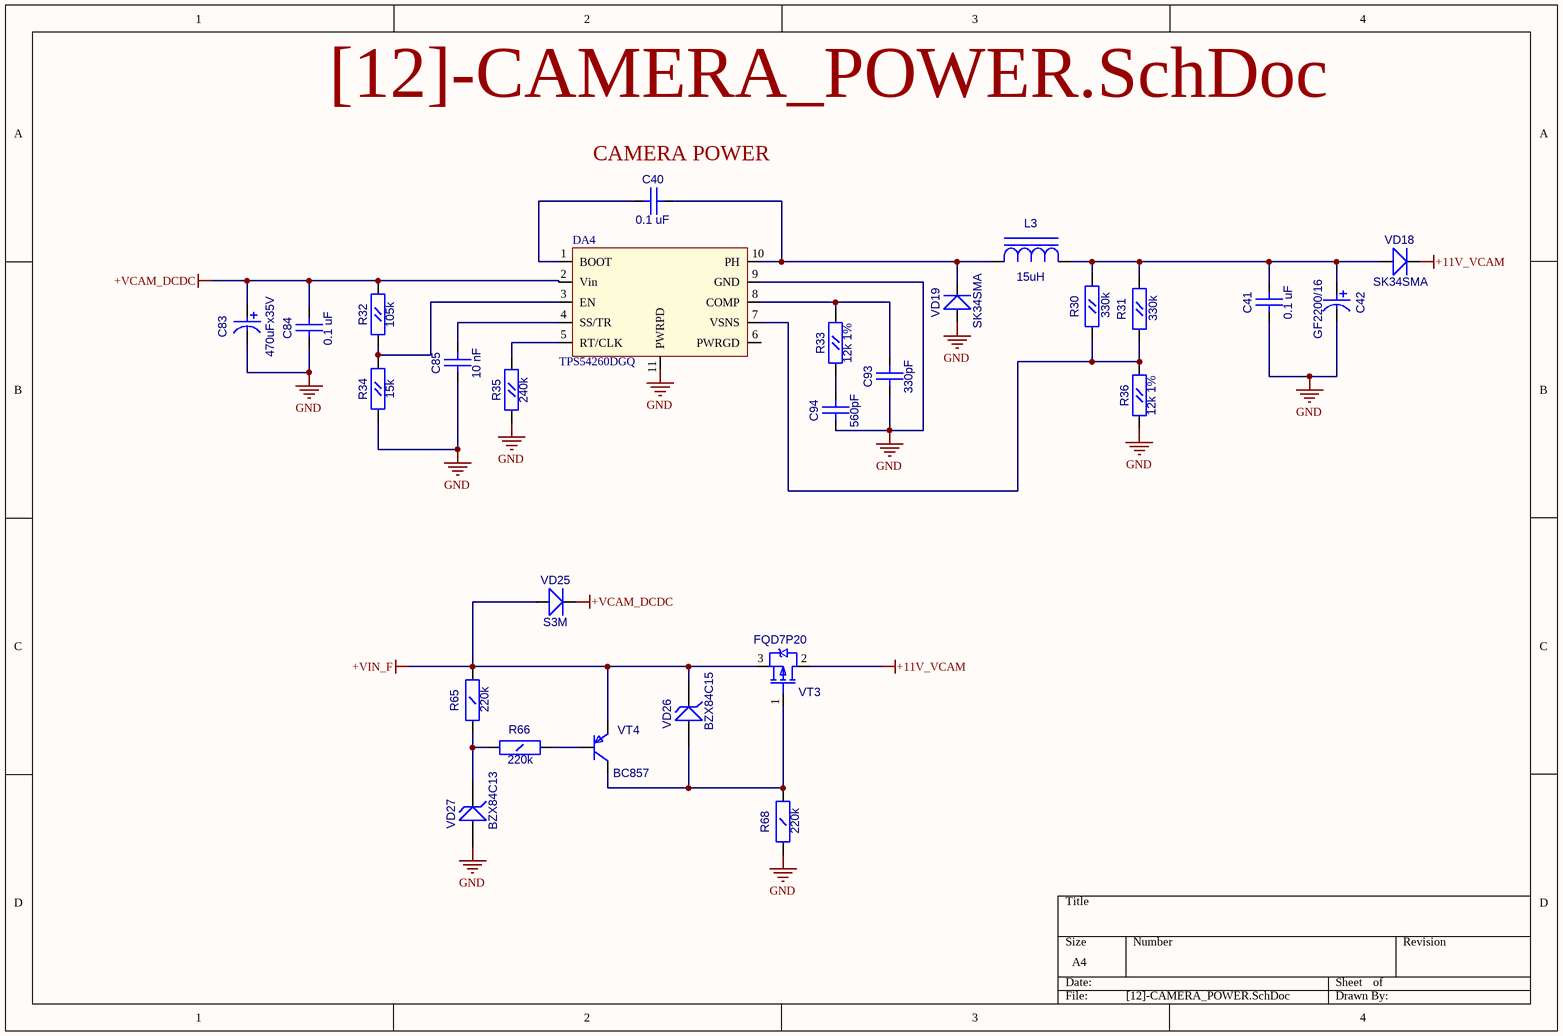
[diagram p10: [12]-CAMERA_POWER.SchDoc]

### Parts
C40  0.1 uF  [CC0603]
C41  0.1 uF  [CC0603]
C42  GF2200/16  [CAP10x20_FLAT]
C83  470uFx35V  [CC16X10_CAP0.5(1)(Primary)]
C84  0.1 uF  [CC0603]
C85  10 nF  [CC0603]
C93  330pF  [CC0603]
C94  560pF  [CC0603]
DA4  TPS54260DGQ  [S-PDSO-G10]
L3  15uH  [SDR0805]
R30  330k  [RC0603]
R31  330k  [RC0603]
R32  105k  [RC0603]
R33  12k 1%  [RC0603]
R34  15k  [RC0603]
R35  240k  [RC0603]
R36  12k 1%  [RC0603]
R65  220k  [RC1206]
R66  220k  [RC1206]
R68  220k  [RC1206]
VD18  SK34SMA  [SMA]
VD19  SK34SMA  [SMA]
VD25  S3M  [SMC]
VD26  BZX84C15  [SOT-23(123)]
VD27  BZX84C13  [SOT-23(123)]
VT3  FQD7P20  [D-PAK(TO-252AA)]
VT4  BC857  [SOT-23(123)]

### Nets
+11V_VCAM: VD18.2(K) VT3.2(D)
+VCAM_DCDC: C83.2 C84.1(A) DA4.2(Vin) R32.2(B) VD25.2(K)
+VIN_F: R65.2(B) VD25.1(A) VD26.3(K) VT3.3(S) VT4.2(E)
GND: C41.2(B) C42.1 C83.1 C84.2(B) C85.2(B) C93.2(B) C94.2(B) DA4.9(GND) DA4.11(PWRPD) R34.1(A) R35.1(A) R36.1(A) R68.1(A) VD19.1(A) VD27.1(A)
NetC40_1: C40.1(A) DA4.10(PH) L3.1(C) VD19.2(K)
NetC40_2: C40.2(B) DA4.1(BOOT)
NetC41_1: C41.1(A) C42.2 L3.2(A) R30.2(B) R31.2(B) VD18.1(A)
NetC85_1: C85.1(A) DA4.4(SS/TR)
NetC93_1: C93.1(A) DA4.8(COMP) R33.2(B)
NetC94_1: C94.1(A) R33.1(A)
NetDA4_3: DA4.3(EN) R32.1(A) R34.2(B)
NetDA4_5: DA4.5(RT/CLK) R35.2(B)
NetDA4_7: DA4.7(VSNS) R30.1(A) R31.1(A) R36.2(B)
NetR65_1: R65.1(A) R66.1(A) VD27.3(K)
NetR66_2: R66.2(B) VT4.1(B)
NetR68_2: R68.2(B) VD26.1(A) VT3.1(G) VT4.3(C)

Not connected (* = marked no-connect by the designer): DA4 6(PWRGD)

### Notes on the sheet
- (near C40) CAMERA POWER

### Library data of the parts
C40 C41 C84 C85 C93 C94 = CC0603
  C40 C41 C84: Value: 0.1 uF
  C85: Value: 10 nF
  C93: Value: 330pF
  C94: Value: 560pF
C42 = CAP_10mm: Radial capacitor; Value: GF2200/16
C83 = CAP0.5(1): Value: 470uFx35V
L3 = SDR0805: Value: 15uH
R30-R36 = RC0603
  R30 R31: Value: 330k
  R32: Value: 105k
  R33 R36: Value: 12k 1%
  R34: Value: 15k
  R35: Value: 240k
R65 R66 R68 = RC1206: Value: 220k
VD18 VD19 = SK34SMA: Schottky Rectifier; Value: {Value}
VD25 = S3A: Schottky Rectifier; Value: S3M
VD26 VD27 = BZX84: Zener Voltage Regulator Diode
  VD26: Value: BZX84C15
  VD27: Value: BZX84C13
VT3 = IRFR9220: as VT19 on sheet [11]-MAIN_POWER; Value: FQD7P20
VT4 = BC857B: as VT20 on sheet [11]-MAIN_POWER; Value: BC857

## Sheet [13]-BACKUP_POWER.SchDoc
size A4
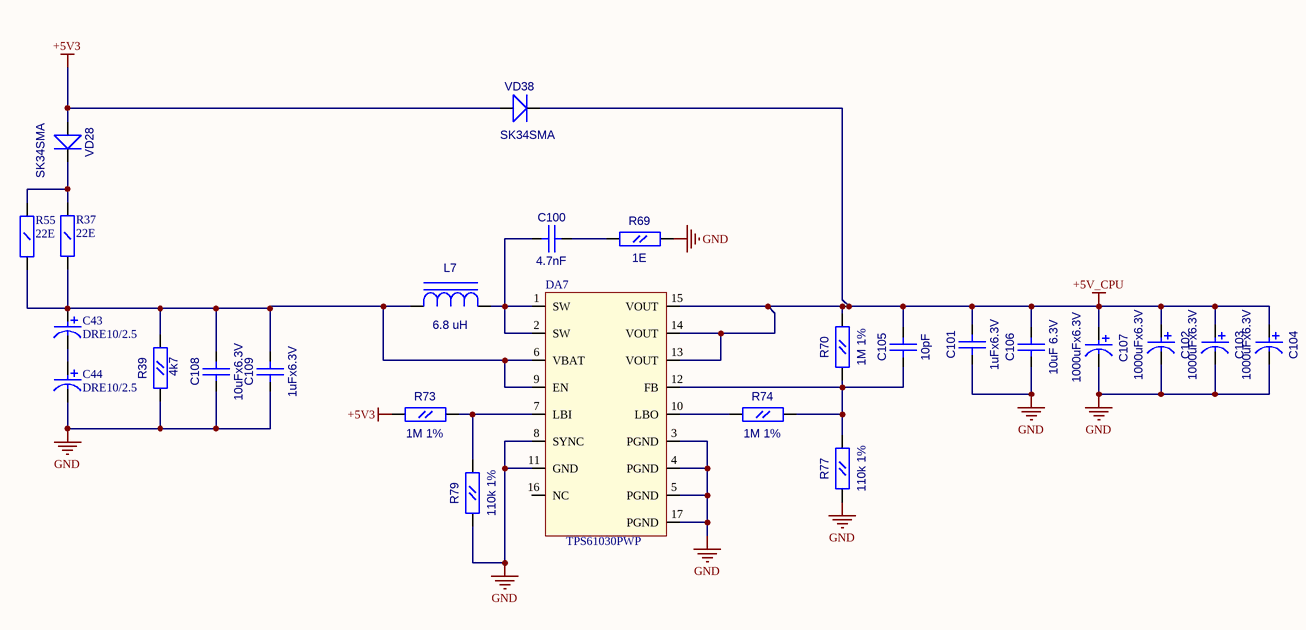
[diagram p11: [13]-BACKUP_POWER.SchDoc]

### Parts
C43  DRE10/2.5  [CAP16_26]
C44  DRE10/2.5  [CAP16_26]
C100  4.7nF  [CC0603]
C101  1uFx6.3V  [CC0603]
C102  value 1000uFx6.3V  [CC8X3.5]  (hidden comment: CAP0.35)
C103  value 1000uFx6.3V  [CC8X3.5]  (hidden comment: CAP0.35)
C104  value 1000uFx6.3V  [CC8X3.5]  (hidden comment: CAP0.35)
C105  10pF  [CC0603]
C106  10uF 6.3V  [CC0805]
C107  value 1000uFx6.3V  [CC8X3.5]  (hidden comment: CAP0.35)
C108  10uFx6.3V  [CC0805]
C109  1uFx6.3V  [CC0603]
DA7  TPS61030PWP  [R-PDSO-G16]
L7  6.8 uH  [SDR0805]
R37  22E  [R2512]
R39  4k7  [RC0603]
R55  22E  [R2512]
R69  1E  [RC0603]
R70  1M 1%  [RC0603]
R73  1M 1%  [RC0603]
R74  1M 1%  [RC0603]
R77  110k 1%  [RC0603]
R79  110k 1%  [RC0603]
VD28  SK34SMA  [SMA]
VD38  SK34SMA  [SMA]

### Nets
+5V3: R73.1(A) VD28.1(A) VD38.1(A)
+5V_CPU: C101.2(B) C102.1 C103.1 C104.1 C105.2(B) C106.2(B) C107.1 DA7.13(VOUT) DA7.14(VOUT) DA7.15(VOUT) R70.2(B) VD38.2(K)  [project net VUSB]
GND: C44.1 C101.1(A) C102.2 C103.2 C104.2 C106.1(A) C107.2 C108.1(A) C109.1(A) DA7.3(PGND) DA7.4(PGND) DA7.5(PGND) DA7.8(SYNC) DA7.11(GND) DA7.17(PGND) R39.1(A) R69.2(B) R77.1(A) R79.1(A)
NetC43_1: C43.1 C44.2
NetC43_2: C43.2 C108.2(B) C109.2(B) DA7.6(VBAT) DA7.9(EN) L7.1(C) R37.1(A) R39.2(B) R55.1(A)
NetC100_1: C100.1(A) DA7.1(SW) DA7.2(SW) L7.2(A)
NetC100_2: C100.2(B) R69.1(A)
NetC105_1: C105.1(A) DA7.12(FB) R70.1(A) R74.2(B) R77.2(B)
NetDA7_7: DA7.7(LBI) R73.2(B) R79.2(B)
NetDA7_10: DA7.10(LBO) R74.1(A)
NetR37_2: R37.2(B) R55.2(B) VD28.2(K)

Not connected (* = marked no-connect by the designer): DA7 16(NC)

### Library data of the parts
C43 C44 = SUPERCAP_10F: Value: DRE10/2.5
C100 C101 C105 C109 = CC0603
  C100: Value: 4.7nF
  C101 C109: Value: 1uFx6.3V
  C105: Value: 10pF
C106 C108 = CC0805
  C106: Value: 10uF 6.3V
  C108: Value: 10uFx6.3V
DA7 = TPS61030PWP: Boost converter
L7 = SDR0805: Value: 6.8 uH
R37 R55 = RC2512: Resistor 2512 1W; Value: 22E
R39 R69 R70 R73 R74 R77 R79 = RC0603
  R39: Value: 4k7
  R69: Value: 1E
  R70 R73 R74: Value: 1M 1%
  R77 R79: Value: 110k 1%
VD28 VD38 = SK34SMA: Schottky Rectifier; Value: {Value}

## Sheet [14]-CURRENT_METER.SchDoc
size A4
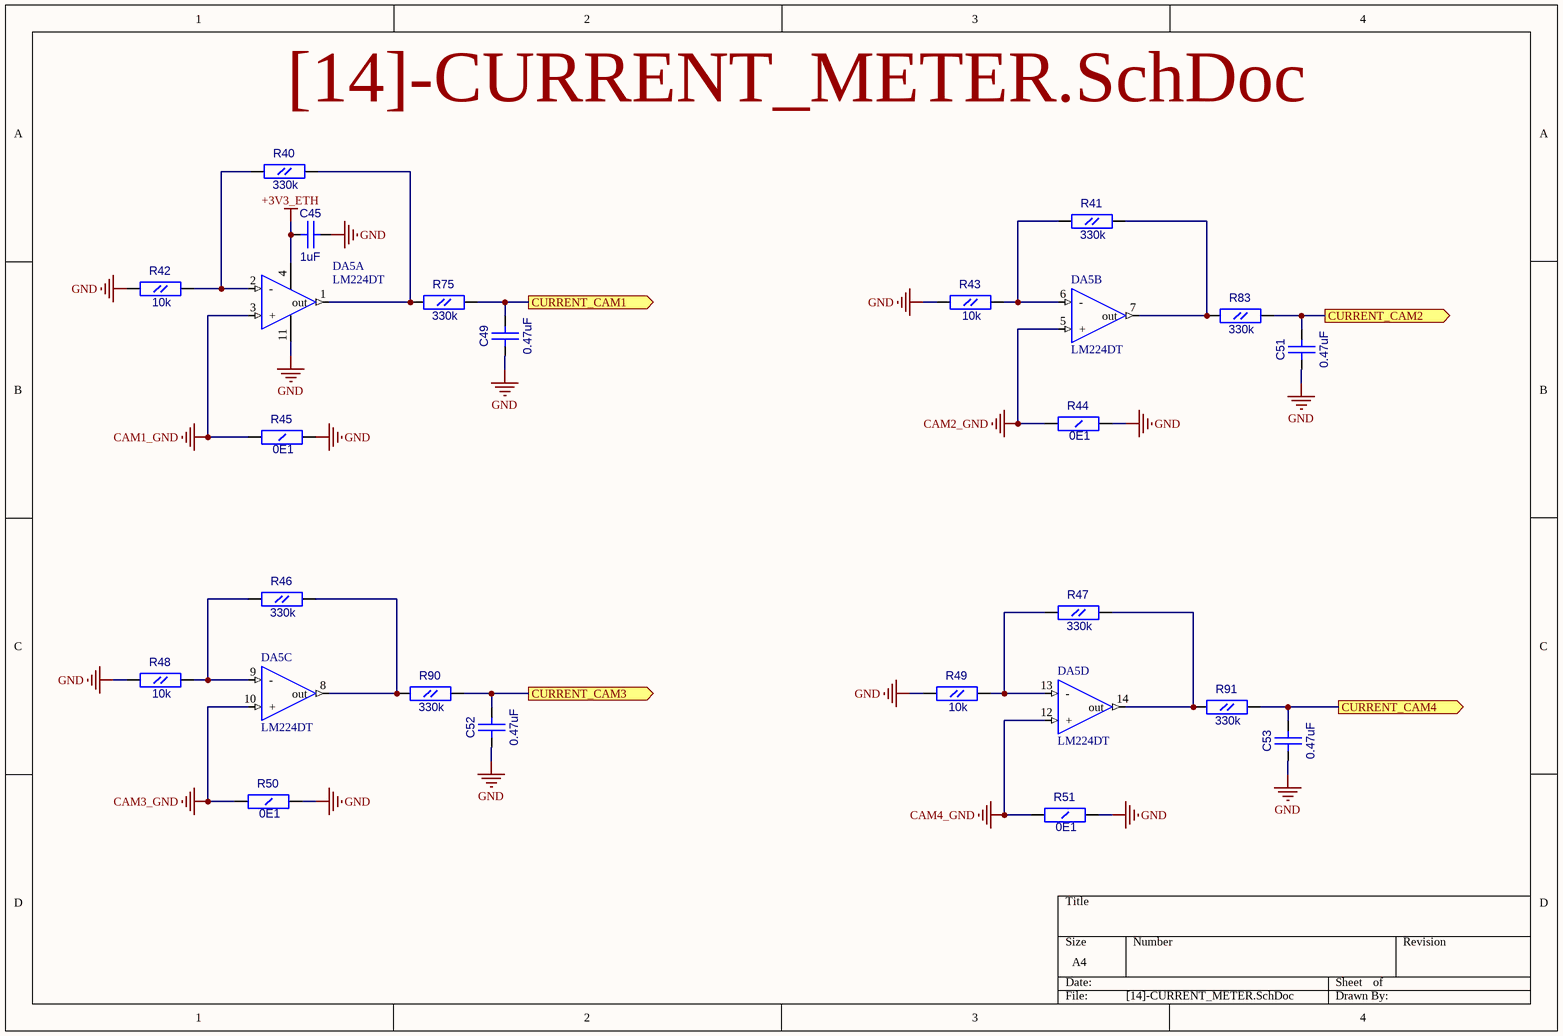
[diagram p12: [14]-CURRENT_METER.SchDoc]

### Parts
C45  1uF  [CC0603]
C49  0.47uF  [CC0603]
C51  0.47uF  [CC0603]
C52  0.47uF  [CC0603]
C53  0.47uF  [CC0603]
DA5  LM224DT  [SO14]  (parts A,B,C,D of 4)
R40  330k  [RC0603]
R41  330k  [RC0603]
R42  10k  [RC0603]
R43  10k  [RC0603]
R44  0E1  [RC1206]
R45  0E1  [RC1206]
R46  330k  [RC0603]
R47  330k  [RC0603]
R48  10k  [RC0603]
R49  10k  [RC0603]
R50  0E1  [RC1206]
R51  0E1  [RC1206]
R75  330k  [RC0603]
R83  330k  [RC0603]
R90  330k  [RC0603]
R91  330k  [RC0603]

### Ports
CURRENT_CAM1 (out), CURRENT_CAM2 (out), CURRENT_CAM3 (out), CURRENT_CAM4 (out)

### Nets
+3V3_ETH: C45.1(A) DA5.4(V+)
CAM1_GND: DA5.3(+) R45.1(A)
CAM2_GND: DA5.5(+) R44.1(A)
CAM3_GND: DA5.10(+) R50.1(A)
CAM4_GND: DA5.12(+) R51.1(A)
GND: C45.2(B) C49.1(A) C51.1(A) C52.1(A) C53.1(A) DA5.11(V-) R42.1(A) R43.1(A) R44.2(B) R45.2(B) R48.1(A) R49.1(A) R50.2(B) R51.2(B)
CURRENT_CAM1: C49.2(B) R75.2(B) ; port CURRENT_CAM1
CURRENT_CAM2: C51.2(B) R83.2(B) ; port CURRENT_CAM2
CURRENT_CAM3: C52.2(B) R90.2(B) ; port CURRENT_CAM3
CURRENT_CAM4: C53.2(B) R91.2(B) ; port CURRENT_CAM4
NetDA5_1: DA5.1(out) R40.2(B) R75.1(A)
NetDA5_2: DA5.2(-) R40.1(A) R42.2(B)
NetDA5_6: DA5.6(-) R41.1(A) R43.2(B)
NetDA5_7: DA5.7(out) R41.2(B) R83.1(A)
NetDA5_8: DA5.8(out) R46.2(B) R90.1(A)
NetDA5_9: DA5.9(-) R46.1(A) R48.2(B)
NetDA5_13: DA5.13(-) R47.1(A) R49.2(B)
NetDA5_14: DA5.14(out) R47.2(B) R91.1(A)

### Library data of the parts
C45 C49 C51-C53 = CC0603
  C45: Value: 1uF
  C49 C51-C53: Value: 0.47uF
DA5 = LM324D: Value: LM224DT
R40-R43 R46-R49 R75 R83 R90 R91 = RC0603
  R40 R41 R46 R47 R75 R83 R90 R91: Value: 330k
  R42 R43 R48 R49: Value: 10k
R44 R45 R50 R51 = RC1206: Value: 0E1

## Sheet [15]-CLOCK.SchDoc
size A4
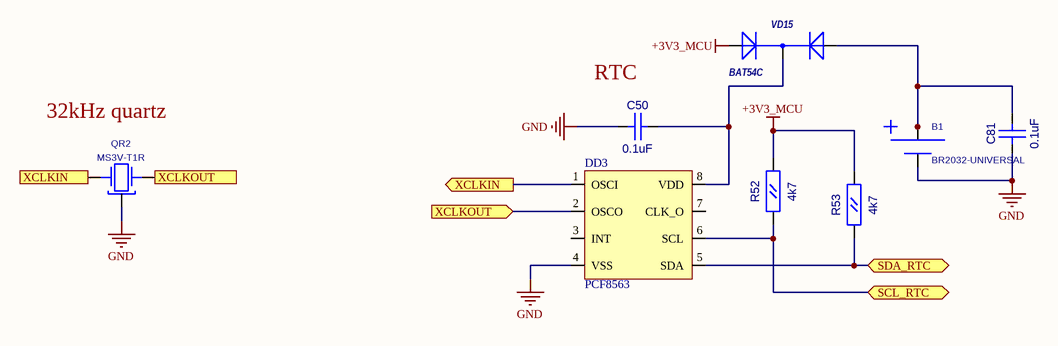
[diagram p13: [15]-CLOCK.SchDoc]

### Parts
B1  BR2032-UNIVERSAL  [BR2032-1GU/1HM]
C50  0.1uF  [CC0603]
C81  0.1uF  [CC0603]
DD3  PCF8563  [SO-8]
QR2  MS3V-T1R  [MS3V-T1R]
R52  4k7  [RC0603]
R53  4k7  [RC0603]
VD15  BAT54C  [SOT-23(123)]

### Ports
SCL_RTC (bidir), SDA_RTC (bidir), XCLKIN (in), XCLKIN (out), XCLKOUT (in), XCLKOUT (out)

### Nets
+3V3_MCU: R52.2(B) R53.2(B) VD15.1(A)
GND: B1.1 C50.1(A) C81.1(A) DD3.4(VSS) QR2.3
SCL_RTC: DD3.6(SCL) R52.1(A) ; port SCL_RTC
SDA_RTC: DD3.5(SDA) R53.1(A) ; port SDA_RTC
NetB1_2: B1.2 B1.3 B1.4 C81.2(B) VD15.2(A)
NetC50_2: C50.2(B) DD3.8(VDD) VD15.3(K)
NetDD3_1: DD3.1(OSCI) QR2.2(X2) ; port XCLKIN
NetDD3_2: DD3.2(OSCO) QR2.1(X1) ; port XCLKOUT

Not connected (* = marked no-connect by the designer): DD3 3(INT) 7(CLK_O)

### Notes on the sheet
- (near C50) RTC
- (near QR2) 32kHz quartz

### Library data of the parts
C50 C81 = CC0603: Value: 0.1uF
QR2 = MS3V-T1R: CRYSTAL_32768 Hz; Value: MS3V-T1R
R52 R53 = RC0603: Value: 4k7
B1 = BR2032-UNIVERSAL: Value: *
DD3 = PCF8563: Value: PCF8563
VD15 = BAT54C: Value: *

## Sheet [16]-ETH_SWITCH.SchDoc
size A4
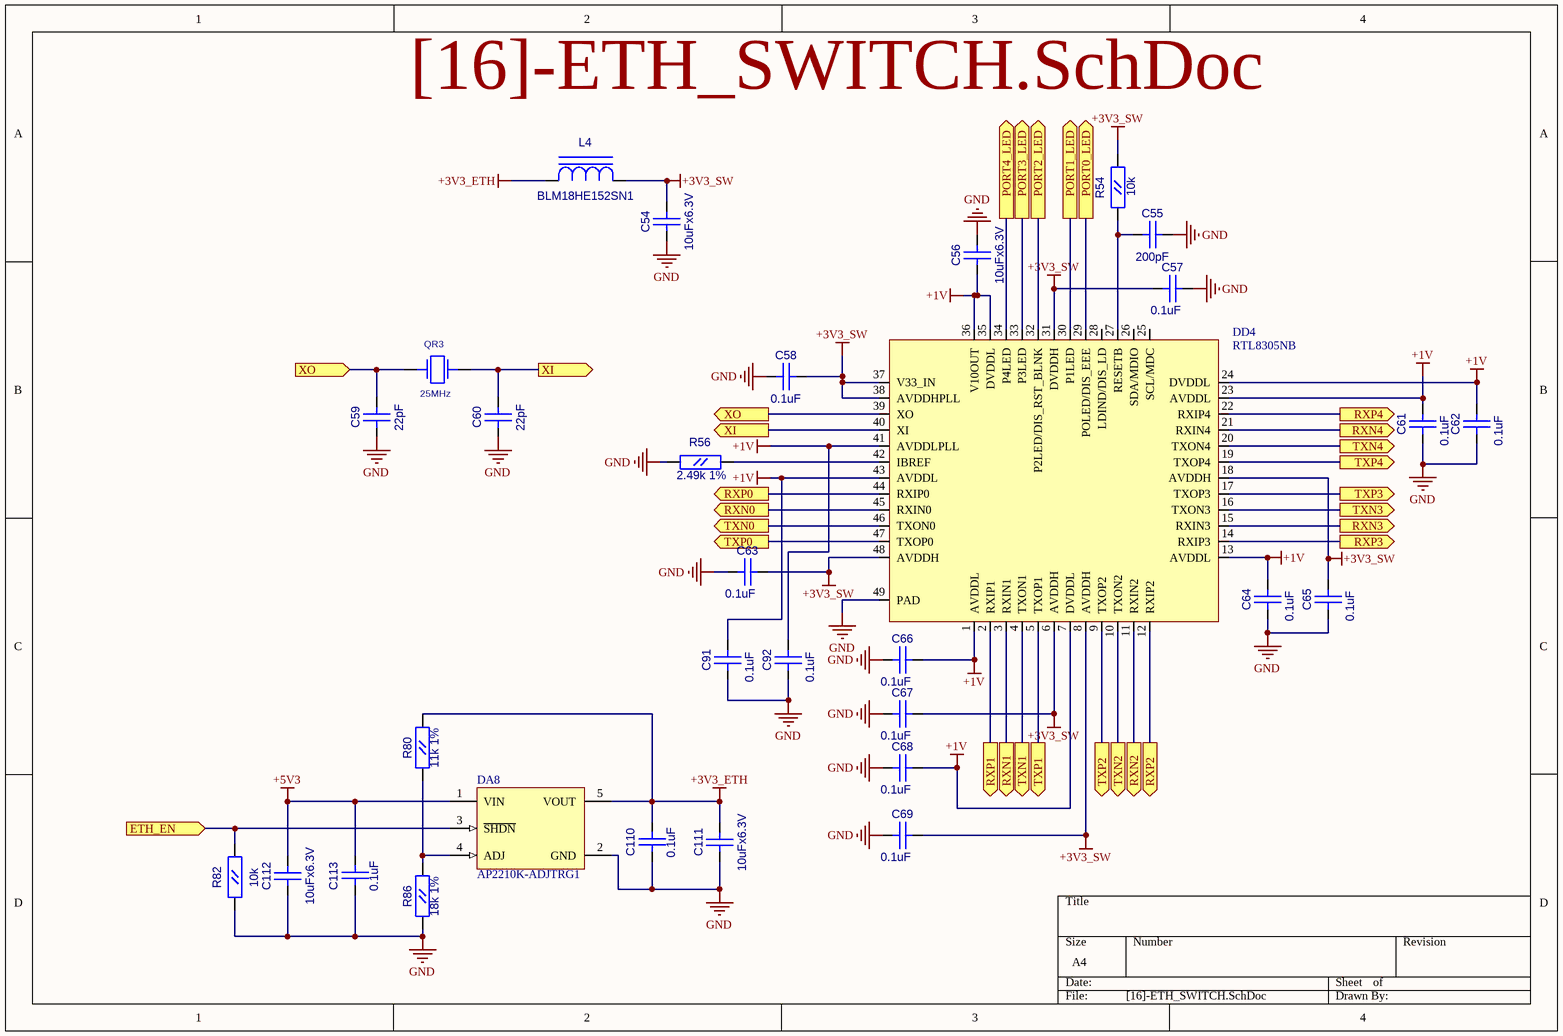
[diagram p14: [16]-ETH_SWITCH.SchDoc]

### Parts
C54  10uFx6.3V  [CC0805]
C55  200pF  [CC0603]
C56  10uFx6.3V  [CC0805]
C57  0.1uF  [CC0603]
C58  0.1uF  [CC0603]
C59  22pF  [CC0603]
C60  22pF  [CC0603]
C61  0.1uF  [CC0603]
C62  0.1uF  [CC0603]
C63  0.1uF  [CC0603]
C64  0.1uF  [CC0603]
C65  0.1uF  [CC0603]
C66  0.1uF  [CC0603]
C67  0.1uF  [CC0603]
C68  0.1uF  [CC0603]
C69  0.1uF  [CC0603]
C91  0.1uF  [CC0603]
C92  0.1uF  [CC0603]
C110  0.1uF  [CC0603]
C111  10uFx6.3V  [CC0805]
C112  10uFx6.3V  [CC0805]
C113  0.1uF  [CC0603]
DA8  AP2210K-ADJTRG1  [SOT23-5]
DD4  RTL8305NB  [QFN48_ISL]
L4  BLM18HE152SN1  [L0603]
QR3  25MHz  [AC5032_2]
R54  10k  [RC0603]
R56  2.49k 1%  [RC0603]
R80  11k 1%  [RC0603]
R82  10k  [RC0603]
R86  18k 1%  [RC0603]

### Ports
ETH_EN (in), PORT0_LED (out), PORT1_LED (out), PORT2_LED (out), PORT3_LED (out), PORT4_LED (out), RXN0 (out), RXN1 (out), RXN2 (out), RXN3 (out), RXN4 (out), RXP0 (out), RXP1 (out), RXP2 (out), RXP3 (out), RXP4 (out), TXN0 (out), TXN1 (out), TXN2 (out), TXN3 (out), TXN4 (out), TXP0 (out), TXP1 (out), TXP2 (out), TXP3 (out), TXP4 (out), XI (out), XO (in), XO (out)

### Nets
+1V: C56.1(A) C61.2(B) C62.2(B) C64.2(B) C66.2(B) C68.2(B) C91.2(B) C92.2(B) DD4.1(AVDDL) DD4.7(DVDDL) DD4.13(AVDDL) DD4.23(AVDDL) DD4.24(DVDDL) DD4.35(DVDDL) DD4.36(V10OUT) DD4.41(AVDDLPLL) DD4.43(AVDDL)
+3V3_ETH: C110.1(A) C111.2(B) DA8.5(VOUT) L4.1(A) R80.2(B)
+3V3_SW: C54.2(B) C57.1(A) C58.2(B) C63.2(B) C65.2(B) C67.2(B) C69.2(B) DD4.6(AVDDH) DD4.8(AVDDH) DD4.18(AVDDH) DD4.31(DVDDH) DD4.37(V33_IN) DD4.38(AVDDHPLL) DD4.48(AVDDH) L4.2(C) R54.2(B)
+5V3: C112.2(B) C113.1(A) DA8.1(VIN)
GND: C54.1(A) C55.2(B) C56.2(B) C57.2(B) C58.1(A) C59.1(A) C60.1(A) C61.1(A) C62.1(A) C63.1(A) C64.1(A) C65.1(A) C66.1(A) C67.1(A) C68.1(A) C69.1(A) C91.1(A) C92.1(A) C110.2(B) C111.1(A) C112.1(A) C113.2(B) DA8.2(GND) DD4.49(PAD) R56.1(A) R82.1(A) R86.1(A)
NetC55_1: C55.1(A) DD4.27(RESETB) R54.1(A)
NetC59_2: C59.2(B) DD4.39(XO) QR3.1 ; port XO
NetC60_2: C60.2(B) DD4.40(XI) QR3.2 ; port XI
NetDA8_3: DA8.3(~{SHDN}) R82.2(B) ; port ETH_EN
NetDA8_4: DA8.4(ADJ) R80.1(A) R86.2(B)
NetDD4_2: DD4.2(RXIP1) ; port RXP1
NetDD4_3: DD4.3(RXIN1) ; port RXN1
NetDD4_4: DD4.4(TXON1) ; port TXN1
NetDD4_5: DD4.5(TXOP1) ; port TXP1
NetDD4_9: DD4.9(TXOP2) ; port TXP2
NetDD4_10: DD4.10(TXON2) ; port TXN2
NetDD4_11: DD4.11(RXIN2) ; port RXN2
NetDD4_12: DD4.12(RXIP2) ; port RXP2
NetDD4_14: DD4.14(RXIP3) ; port RXP3
NetDD4_15: DD4.15(RXIN3) ; port RXN3
NetDD4_16: DD4.16(TXON3) ; port TXN3
NetDD4_17: DD4.17(TXOP3) ; port TXP3
NetDD4_19: DD4.19(TXOP4) ; port TXP4
NetDD4_20: DD4.20(TXON4) ; port TXN4
NetDD4_21: DD4.21(RXIN4) ; port RXN4
NetDD4_22: DD4.22(RXIP4) ; port RXP4
NetDD4_29: DD4.29(POLED/DIS_EEE) ; port PORT0_LED
NetDD4_30: DD4.30(P1LED) ; port PORT1_LED
NetDD4_32: DD4.32(P2LED/DIS_RST_BLNK) ; port PORT2_LED
NetDD4_33: DD4.33(P3LED) ; port PORT3_LED
NetDD4_34: DD4.34(P4LED) ; port PORT4_LED
NetDD4_42: DD4.42(IBREF) R56.2(B)
NetDD4_44: DD4.44(RXIP0) ; port RXP0
NetDD4_45: DD4.45(RXIN0) ; port RXN0
NetDD4_46: DD4.46(TXON0) ; port TXN0
NetDD4_47: DD4.47(TXOP0) ; port TXP0

Not connected (* = marked no-connect by the designer): DD4 25(SCL/MDC) 26(SDA/MDIO) 28(LDIND/DIS_LD)

### Library data of the parts
C54 C56 C111 C112 = CC0805: Value: 10uFx6.3V
C55 C57-C69 C91 C92 C110 C113 = CC0603
  C55: Value: 200pF
  C57 C58 C61-C69 C91 C92 C110 C113: Value: 0.1uF
  C59 C60: Value: 22pF
DA8 = MCP1824T-ADJE/OT: as DA1 on sheet [4]-MCU_POWER; Published: 29-Jan-2009; DatasheetVersion: revA, Aug-2007; PackageVersion: revAW, Oct-2008; PackageReference: SOT-223-DC5; Publisher: Altium Limited; PackageDescription: 5-Lead Plastic Small Outline Transistor (DC) [SOT-223]; ComponentLink1Description: Manufacturer Link; ComponentLink1URL: http://www.microchip.com; ComponentLink2Description: Datasheet; ComponentLink2URL: http://ww1.microchip.com/downloads/en/DeviceDoc/22070a.pdf; ComponentLink3Description: Packaging Specification; ComponentLink3URL: http://ww1.microchip.com/downloads/en/PackagingSpec/00049AW.pdf
L4 = L0603: Value: BLM18HE152SN1
QR3 = AC5032_2: AC5032/2; Value: 25MHz
R54 R56 R80 R82 R86 = RC0603
  R54 R82: Value: 10k
  R56: Value: 2.49k 1%
  R80: Value: 11k 1%
  R86: Value: 18k 1%
DD4 = RTL8305NB: Value: RTL8305NB

## Sheet [17]-ETH_CONNECTOR.SchDoc
size A4
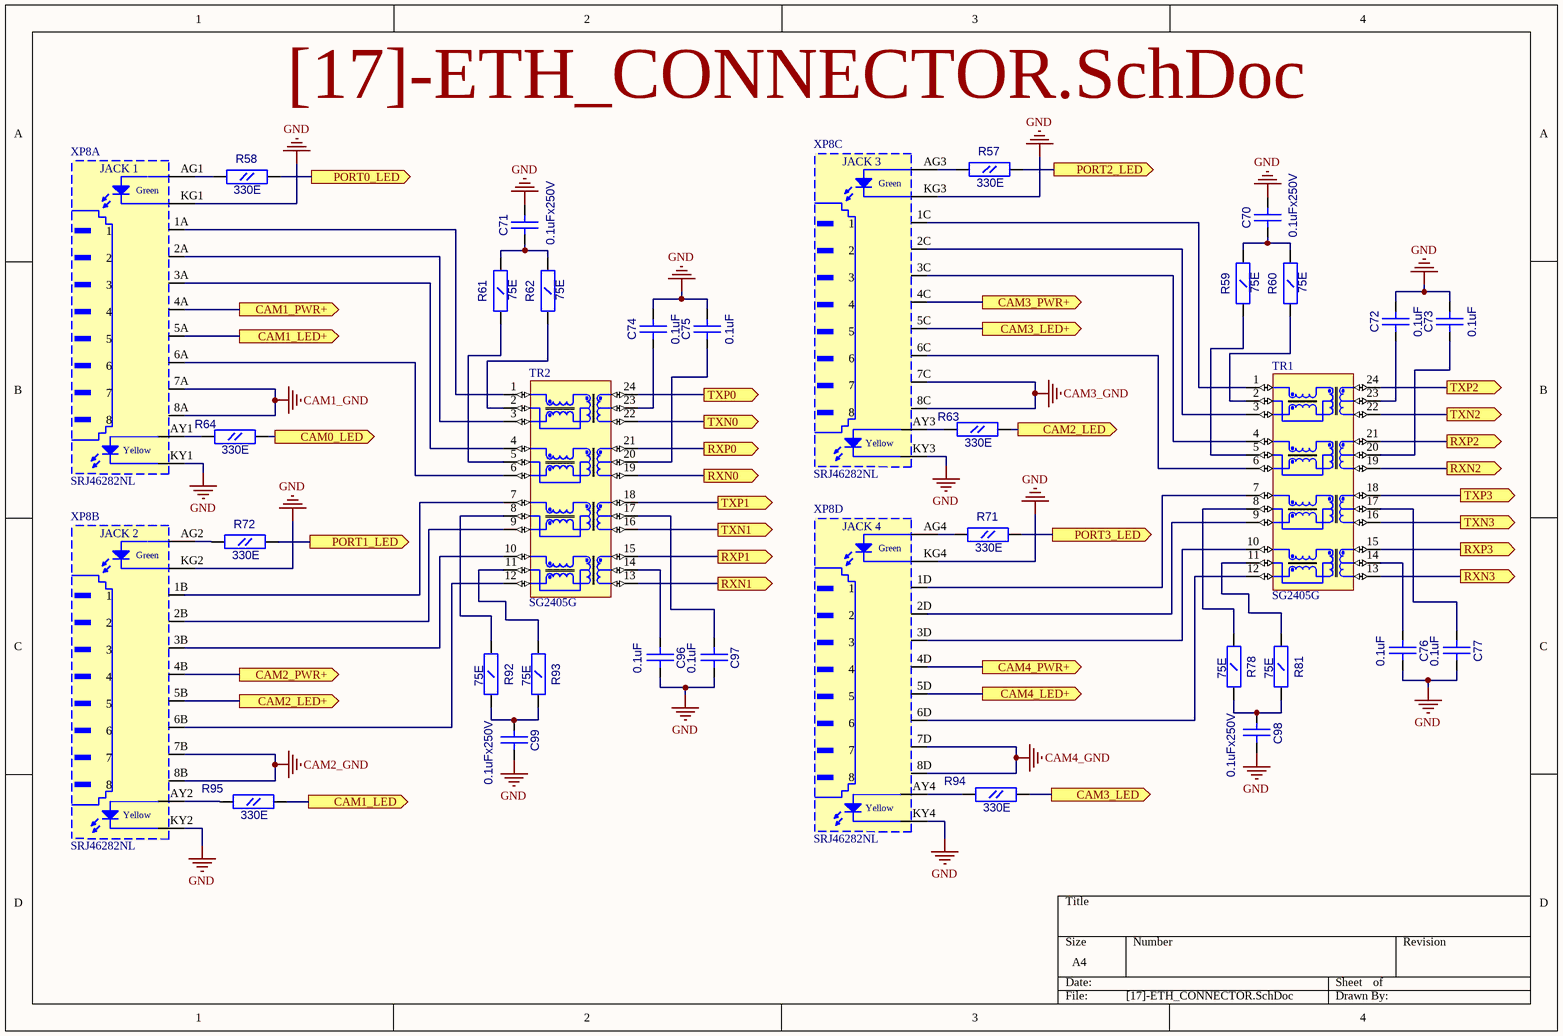
[diagram p15: [17]-ETH_CONNECTOR.SchDoc]

### Parts
C70  0.1uFx250V  [CC1206]
C71  0.1uFx250V  [CC1206]
C72  0.1uF  [CC0603]
C73  0.1uF  [CC0603]
C74  0.1uF  [CC0603]
C75  0.1uF  [CC0603]
C76  0.1uF  [CC0603]
C77  0.1uF  [CC0603]
C96  0.1uF  [CC0603]
C97  0.1uF  [CC0603]
C98  0.1uFx250V  [CC1206]
C99  0.1uFx250V  [CC1206]
R57  330E  [RC0603]
R58  330E  [RC0603]
R59  75E  [RC1206]
R60  75E  [RC1206]
R61  75E  [RC1206]
R62  75E  [RC1206]
R63  330E  [RC0603]
R64  330E  [RC0603]
R71  330E  [RC0603]
R72  330E  [RC0603]
R78  75E  [RC1206]
R81  75E  [RC1206]
R92  75E  [RC1206]
R93  75E  [RC1206]
R94  330E  [RC0603]
R95  330E  [RC0603]
TR1  SG2405G  [SG2405G]
TR2  SG2405G  [SG2405G]
XP8  SRJ46282NL  [SRJ46282NL]  (parts A,B,C,D of 4)

### Ports
CAM0_LED (out), CAM1_LED (out), CAM1_LED+ (out), CAM1_PWR+ (out), CAM2_LED (out), CAM2_LED+ (out), CAM2_PWR+ (out), CAM3_LED (out), CAM3_LED+ (out), CAM3_PWR+ (out), CAM4_LED+ (out), CAM4_PWR+ (out), PORT0_LED (out), PORT1_LED (out), PORT2_LED (out), PORT3_LED (out), RXN0 (out), RXN1 (out), RXN2 (out), RXN3 (out), RXP0 (out), RXP1 (out), RXP2 (out), RXP3 (out), TXN0 (out), TXN1 (out), TXN2 (out), TXN3 (out), TXP0 (out), TXP1 (out), TXP2 (out), TXP3 (out)

### Nets
CAM1_GND: XP8.7A XP8.8A
CAM2_GND: XP8.7B XP8.8B
CAM3_GND: XP8.7C XP8.8C
CAM4_GND: XP8.7D XP8.8D
GND: C70.2(B) C71.2(B) C72.2(B) C73.2(B) C74.2(B) C75.2(B) C76.2(B) C77.2(B) C96.2(B) C97.2(B) C98.2(B) C99.2(B) XP8.KG1(D2) XP8.KG2(D2) XP8.KG3(D2) XP8.KG4(D2) XP8.KY1(D4) XP8.KY2(D4) XP8.KY3(D4) XP8.KY4(D4)
CAM0_LED: R64.2(B) ; port CAM0_LED
CAM1_LED: R95.2(B) ; port CAM1_LED
CAM2_LED: R63.2(B) ; port CAM2_LED
CAM3_LED: R94.2(B) ; port CAM3_LED
NetC70_1: C70.1(A) R59.2(B) R60.2(B)
NetC71_1: C71.1(A) R61.2(B) R62.2(B)
NetC72_1: C72.1(A) TR1.23(RXCT1)
NetC73_1: C73.1(A) TR1.20(TXCT1)
NetC74_1: C74.1(A) TR2.23(RXCT1)
NetC75_1: C75.1(A) TR2.20(TXCT1)
NetC76_1: C76.1(A) TR1.14(RXCT2)
NetC77_1: C77.1(A) TR1.17(TXCT2)
NetC96_1: C96.1(A) TR2.14(RXCT2)
NetC97_1: C97.1(A) TR2.17(TXCT2)
NetC98_1: C98.1(A) R78.2(B) R81.2(B)
NetC99_1: C99.1(A) R92.2(B) R93.2(B)
NetDD4_2: TR2.15(RX2+) ; port RXP1
NetDD4_3: TR2.13(RX2-) ; port RXN1
NetDD4_4: TR2.16(TX2-) ; port TXN1
NetDD4_5: TR2.18(TX2+) ; port TXP1
NetDD4_9: TR1.24(RX1+) ; port TXP2
NetDD4_10: TR1.22(RX1-) ; port TXN2
NetDD4_11: TR1.19(TX1-) ; port RXN2
NetDD4_12: TR1.21(TX1+) ; port RXP2
NetDD4_14: TR1.15(RX2+) ; port RXP3
NetDD4_15: TR1.13(RX2-) ; port RXN3
NetDD4_16: TR1.16(TX2-) ; port TXN3
NetDD4_17: TR1.18(TX2+) ; port TXP3
NetDD4_29: R58.2(B) ; port PORT0_LED
NetDD4_30: R72.2(B) ; port PORT1_LED
NetDD4_32: R57.2(B) ; port PORT2_LED
NetDD4_33: R71.2(B) ; port PORT3_LED
NetDD4_44: TR2.21(TX1+) ; port RXP0
NetDD4_45: TR2.19(TX1-) ; port RXN0
NetDD4_46: TR2.22(RX1-) ; port TXN0
NetDD4_47: TR2.24(RX1+) ; port TXP0
NetR57_1: R57.1(A) XP8.AG3(D1)
NetR58_1: R58.1(A) XP8.AG1(D1)
NetR59_1: R59.1(A) TR1.5(TCT1)
NetR60_1: R60.1(A) TR1.2(RCT1)
NetR61_1: R61.1(A) TR2.5(TCT1)
NetR62_1: R62.1(A) TR2.2(RCT1)
NetR63_1: R63.1(A) XP8.AY3(D3)
NetR64_1: R64.1(A) XP8.AY1(D3)
NetR71_1: R71.1(A) XP8.AG4(D1)
NetR72_1: R72.1(A) XP8.AG2(D1)
NetR78_1: R78.1(A) TR1.8(TCT2)
NetR81_1: R81.1(A) TR1.11(RCT2)
NetR92_1: R92.1(A) TR2.8(TCT2)
NetR93_1: R93.1(A) TR2.11(RCT2)
NetR94_1: R94.1(A) XP8.AY4(D3)
NetR95_1: R95.1(A) XP8.AY2(D3)
NetTR1_1: TR1.1(RD1+) XP8.1C
NetTR1_3: TR1.3(RD1-) XP8.2C
NetTR1_4: TR1.4(TD1+) XP8.3C
NetTR1_6: TR1.6(TD1-) XP8.6C
NetTR1_7: TR1.7(TD2+) XP8.1D
NetTR1_9: TR1.9(TD2-) XP8.2D
NetTR1_10: TR1.10(RD2+) XP8.3D
NetTR1_12: TR1.12(RD2-) XP8.6D
NetTR2_1: TR2.1(RD1+) XP8.1A
NetTR2_3: TR2.3(RD1-) XP8.2A
NetTR2_4: TR2.4(TD1+) XP8.3A
NetTR2_6: TR2.6(TD1-) XP8.6A
NetTR2_7: TR2.7(TD2+) XP8.1B
NetTR2_9: TR2.9(TD2-) XP8.2B
NetTR2_10: TR2.10(RD2+) XP8.3B
NetTR2_12: TR2.12(RD2-) XP8.6B
NetVD30_2: XP8.4C ; port CAM3_PWR+
NetVD31_2: XP8.4D ; port CAM4_PWR+
NetVD32_2: XP8.4A ; port CAM1_PWR+
NetVD33_2: XP8.5C ; port CAM3_LED+
NetVD34_2: XP8.5D ; port CAM4_LED+
NetVD35_2: XP8.5A ; port CAM1_LED+
NetVD36_2: XP8.4B ; port CAM2_PWR+
NetVD37_2: XP8.5B ; port CAM2_LED+

### Notes on the sheet
- (in symbol SRJ46282NL, part A) JACK 1; Green; 2; 3; 4; 5; 6; 7; 8; Yellow
- (in symbol SRJ46282NL, part B) JACK 2; Green; 2; 3; 4; 5; 6; 7; 8; Yellow
- (in symbol SRJ46282NL, part C) JACK 3; Green; 2; 3; 4; 5; 6; 7; 8; Yellow
- (in symbol SRJ46282NL, part D) JACK 4; Green; 2; 3; 4; 5; 6; 7; 8; Yellow

### Library data of the parts
C70 C71 C98 C99 = CC1206: Value: 0.1uFx250V
C72-C77 C96 C97 = CC0603: Value: 0.1uF
R57 R58 R63 R64 R71 R72 R94 R95 = RC0603: Value: 330E
R59-R62 R78 R81 R92 R93 = RC1206: Value: 75E
TR1 TR2 = SG2405G: Ehternet transformer Gigabit or 2 LAN10/100; Value: SG2405G
XP8 = SRJ46282NL: Value: SRJ46282NL

## Sheet [18]-WIFI_MODULE.SchDoc
size A4
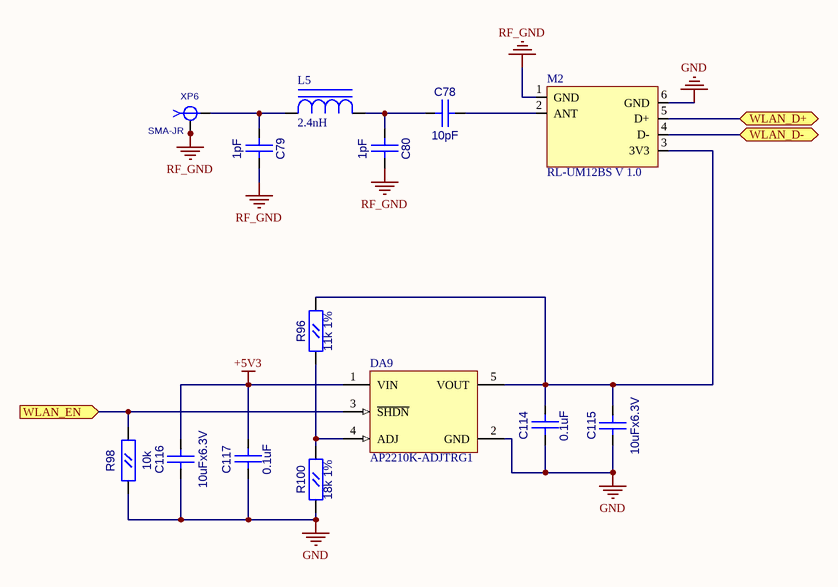
[diagram p16: [18]-WIFI_MODULE.SchDoc]

### Parts
C78  10pF  [CC0603]
C79  1pF  [CC0603]
C80  1pF  [CC0603]
C114  0.1uF  [CC0603]
C115  10uFx6.3V  [CC0805]
C116  10uFx6.3V  [CC0805]
C117  0.1uF  [CC0603]
DA9  AP2210K-ADJTRG1  [SOT23-5]
L5  2.4nH  [L0402]
M2  RL-UM12BS V 1.0  [RTL8188_MODULE]
R96  11k 1%  [RC0603]
R98  10k  [RC0603]
R100  18k 1%  [RC0603]
XP6  SMA-JR  [SMA-JR]

### Ports
WLAN_D+ (bidir), WLAN_D- (bidir), WLAN_EN (in)

### Nets
+5V3: C116.2(B) C117.1(A) DA9.1(VIN)
GND: C114.2(B) C115.1(A) C116.1(A) C117.2(B) DA9.2(GND) M2.6(GND) R98.1(A) R100.1(A)
RF_GND: C79.2(B) C80.2(B) M2.1(GND) XP6.2 XP6.3 XP6.4 XP6.5
WLAN_D+: M2.5(D+) ; port WLAN_D+
WLAN_D-: M2.4(D-) ; port WLAN_D-
WLAN_EN: DA9.3(~{SHDN}) R98.2(B) ; port WLAN_EN
NetC78_1: C78.1(A) C80.1(A) L5.2(C)
NetC78_2: C78.2(B) M2.2(ANT)
NetC79_1: C79.1(A) L5.1(A) XP6.1
NetC114_1: C114.1(A) C115.2(B) DA9.5(VOUT) M2.3(3V3) R96.2(B)
NetDA9_4: DA9.4(ADJ) R96.1(A) R100.2(B)

### Library data of the parts
C78-C80 C114 C117 = CC0603
  C78: Value: 10pF
  C79 C80: Value: 1pF
  C114 C117: Value: 0.1uF
C115 C116 = CC0805: Value: 10uFx6.3V
DA9 = MCP1824T-ADJE/OT: as DA1 on sheet [4]-MCU_POWER; Published: 29-Jan-2009; DatasheetVersion: revA, Aug-2007; PackageVersion: revAW, Oct-2008; PackageReference: SOT-223-DC5; Publisher: Altium Limited; PackageDescription: 5-Lead Plastic Small Outline Transistor (DC) [SOT-223]; ComponentLink1Description: Manufacturer Link; ComponentLink1URL: http://www.microchip.com; ComponentLink2Description: Datasheet; ComponentLink2URL: http://ww1.microchip.com/downloads/en/DeviceDoc/22070a.pdf; ComponentLink3Description: Packaging Specification; ComponentLink3URL: http://ww1.microchip.com/downloads/en/PackagingSpec/00049AW.pdf
L5 = L0402: Value: 2.4nH
M2 = RTL8188_MODULE: Value: RL-UM12BS V 1.0
R96 R98 R100 = RC0603
  R96: Value: 11k 1%
  R98: Value: 10k
  R100: Value: 18k 1%
XP6 = SMA-JR: Value: SMA-JR

## Sheet [19]-CAMERA_PWR_CONNECTORS.SchDoc
size A4
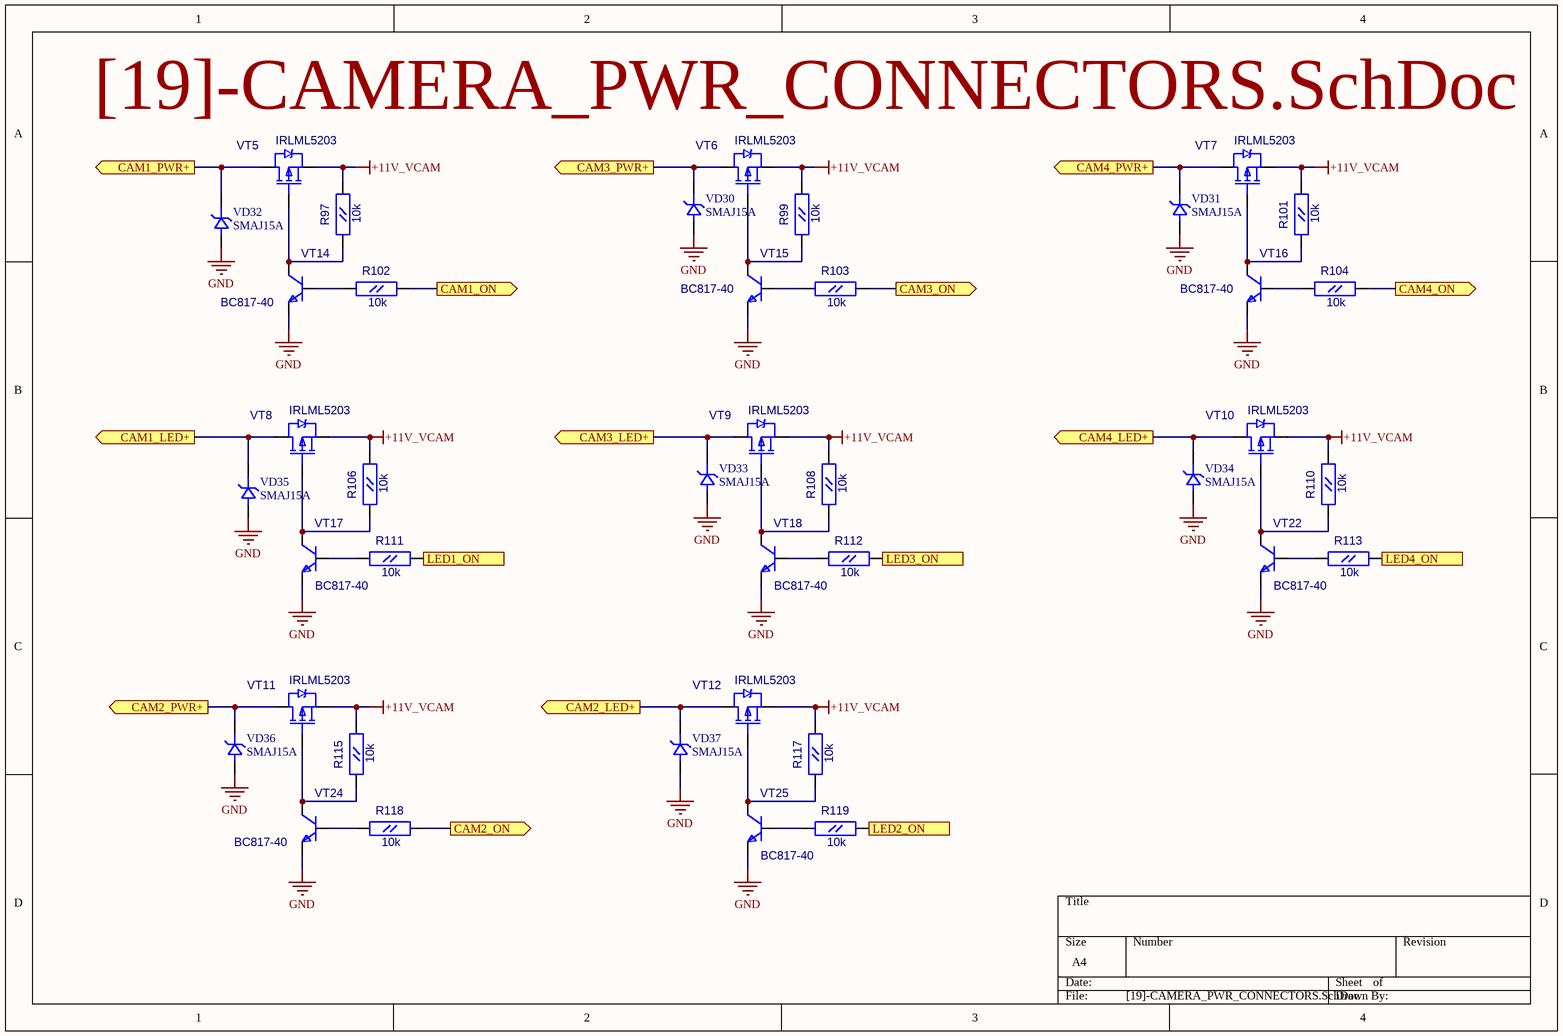
[diagram p17: [19]-CAMERA_PWR_CONNECTORS.SchDoc]

### Parts
R97  10k  [RC0603]
R99  10k  [RC0603]
R101  10k  [RC0603]
R102  10k  [RC0603]
R103  10k  [RC0603]
R104  10k  [RC0603]
R106  10k  [RC0603]
R108  10k  [RC0603]
R110  10k  [RC0603]
R111  10k  [RC0603]
R112  10k  [RC0603]
R113  10k  [RC0603]
R115  10k  [RC0603]
R117  10k  [RC0603]
R118  10k  [RC0603]
R119  10k  [RC0603]
VD30  SMAJ15A  [SMA]
VD31  SMAJ15A  [SMA]
VD32  SMAJ15A  [SMA]
VD33  SMAJ15A  [SMA]
VD34  SMAJ15A  [SMA]
VD35  SMAJ15A  [SMA]
VD36  SMAJ15A  [SMA]
VD37  SMAJ15A  [SMA]
VT5  IRLML5203  [SOT-23(123)]
VT6  IRLML5203  [SOT-23(123)]
VT7  IRLML5203  [SOT-23(123)]
VT8  IRLML5203  [SOT-23(123)]
VT9  IRLML5203  [SOT-23(123)]
VT10  IRLML5203  [SOT-23(123)]
VT11  IRLML5203  [SOT-23(123)]
VT12  IRLML5203  [SOT-23(123)]
VT14  BC817-40  [SOT-23(123)]
VT15  BC817-40  [SOT-23(123)]
VT16  BC817-40  [SOT-23(123)]
VT17  BC817-40  [SOT-23(123)]
VT18  BC817-40  [SOT-23(123)]
VT22  BC817-40  [SOT-23(123)]
VT24  BC817-40  [SOT-23(123)]
VT25  BC817-40  [SOT-23(123)]

### Ports
CAM1_LED+ (out), CAM1_ON (out), CAM1_PWR+ (out), CAM2_LED+ (out), CAM2_ON (out), CAM2_PWR+ (out), CAM3_LED+ (out), CAM3_ON (out), CAM3_PWR+ (out), CAM4_LED+ (out), CAM4_ON (out), CAM4_PWR+ (out), LED1_ON (out), LED2_ON (out), LED3_ON (out), LED4_ON (out)

### Nets
+11V_VCAM: R97.2(B) R99.2(B) R101.2(B) R106.2(B) R108.2(B) R110.2(B) R115.2(B) R117.2(B) VT5.2(S) VT6.2(S) VT7.2(S) VT8.2(S) VT9.2(S) VT10.2(S) VT11.2(S) VT12.2(S)
GND: VD30.1(A) VD31.1(A) VD32.1(A) VD33.1(A) VD34.1(A) VD35.1(A) VD36.1(A) VD37.1(A) VT14.2(E) VT15.2(E) VT16.2(E) VT17.2(E) VT18.2(E) VT22.2(E) VT24.2(E) VT25.2(E)
CAM1_ON: R102.2(B) ; port CAM1_ON
CAM2_ON: R118.2(B) ; port CAM2_ON
CAM3_ON: R103.2(B) ; port CAM3_ON
CAM4_ON: R104.2(B) ; port CAM4_ON
LED1_ON: R111.2(B) ; port LED1_ON
LED2_ON: R119.2(B) ; port LED2_ON
LED3_ON: R112.2(B) ; port LED3_ON
LED4_ON: R113.2(B) ; port LED4_ON
NetR97_1: R97.1(A) VT5.1(G) VT14.3(C)
NetR99_1: R99.1(A) VT6.1(G) VT15.3(C)
NetR101_1: R101.1(A) VT7.1(G) VT16.3(C)
NetR102_1: R102.1(A) VT14.1(B)
NetR103_1: R103.1(A) VT15.1(B)
NetR104_1: R104.1(A) VT16.1(B)
NetR106_1: R106.1(A) VT8.1(G) VT17.3(C)
NetR108_1: R108.1(A) VT9.1(G) VT18.3(C)
NetR110_1: R110.1(A) VT10.1(G) VT22.3(C)
NetR111_1: R111.1(A) VT17.1(B)
NetR112_1: R112.1(A) VT18.1(B)
NetR113_1: R113.1(A) VT22.1(B)
NetR115_1: R115.1(A) VT11.1(G) VT24.3(C)
NetR117_1: R117.1(A) VT12.1(G) VT25.3(C)
NetR118_1: R118.1(A) VT24.1(B)
NetR119_1: R119.1(A) VT25.1(B)
NetVD30_2: VD30.2(K) VT6.3(D) ; port CAM3_PWR+
NetVD31_2: VD31.2(K) VT7.3(D) ; port CAM4_PWR+
NetVD32_2: VD32.2(K) VT5.3(D) ; port CAM1_PWR+
NetVD33_2: VD33.2(K) VT9.3(D) ; port CAM3_LED+
NetVD34_2: VD34.2(K) VT10.3(D) ; port CAM4_LED+
NetVD35_2: VD35.2(K) VT8.3(D) ; port CAM1_LED+
NetVD36_2: VD36.2(K) VT11.3(D) ; port CAM2_PWR+
NetVD37_2: VD37.2(K) VT12.3(D) ; port CAM2_LED+

### Library data of the parts
R97 R99 R101-R104 R106 R108 R110-R113 R115 R117-R119 = RC0603: Value: 10k
VD30-VD37 = SMAJ: Value: SMAJ15A
VT5-VT12 = IRLML6402: as VT1 on sheet [7]-H3_POWER; Value: IRLML5203
VT14-VT18 VT22 VT24 VT25 = BC846BLT1: NPN 500ma transistor; ComponentField7: Published 29-Sep-2000; OriginalName: BC846BLT1; Value: BC817-40

## Sheet [20]-CONNECT_CONNECTORS.SchDoc
size A4
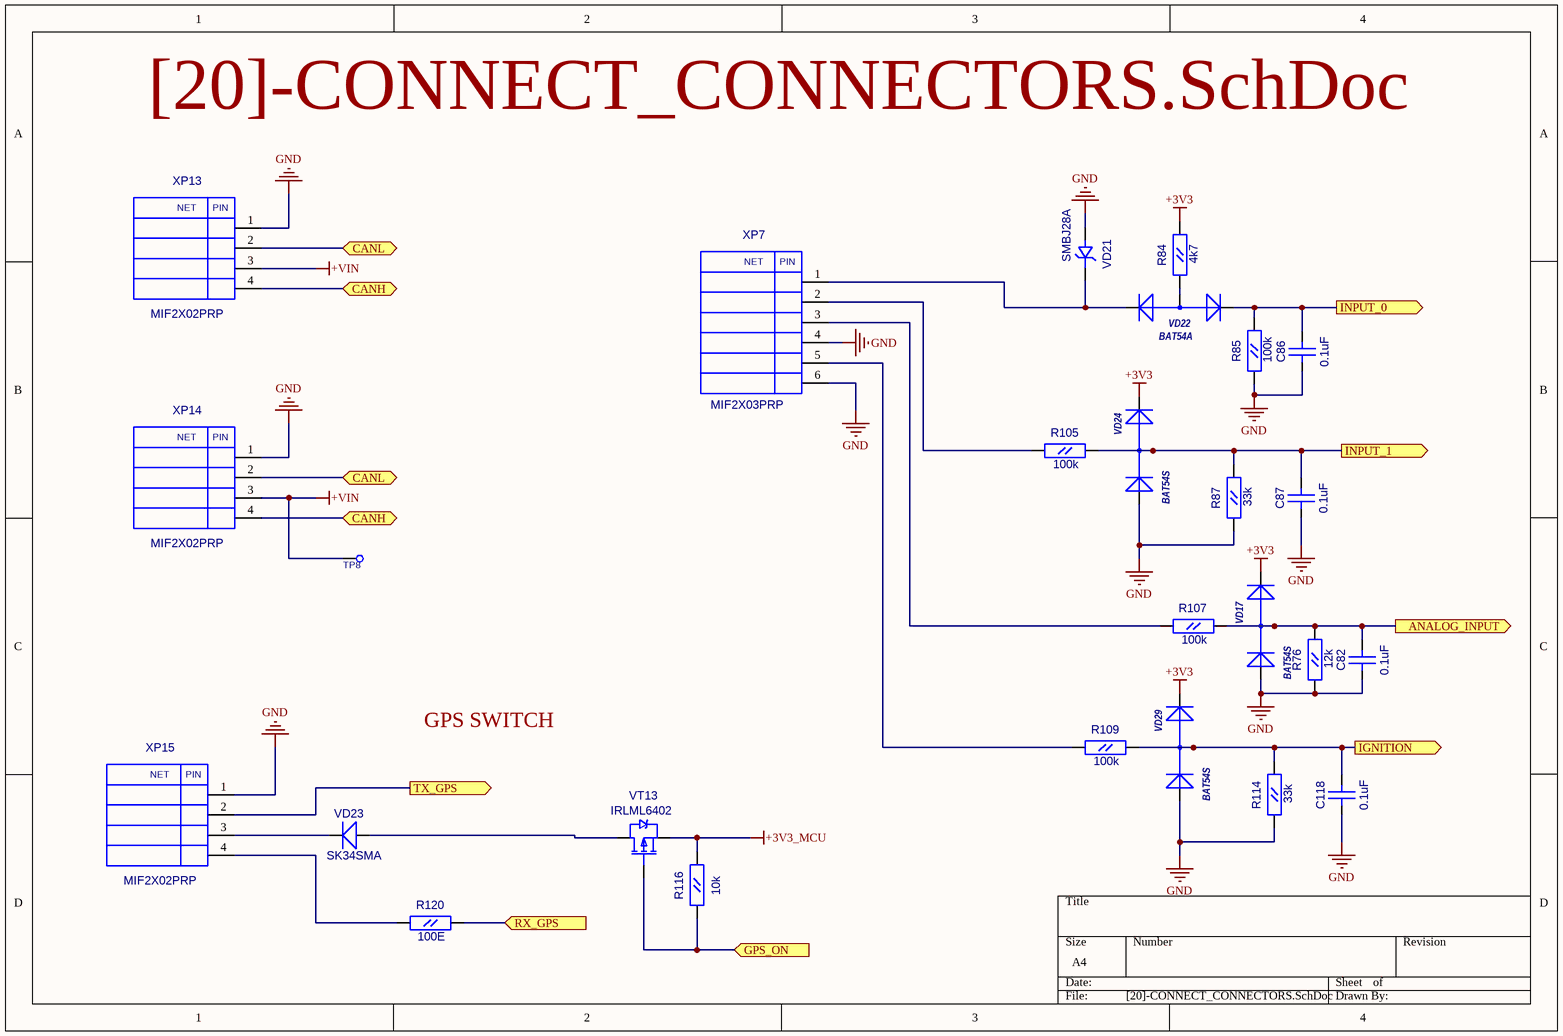
[diagram p18: [20]-CONNECT_CONNECTORS.SchDoc]

### Parts
C82  0.1uF  [CC0603]
C86  0.1uF  [CC0603]
C87  0.1uF  [CC0603]
C118  0.1uF  [CC0603]
R76  12k  [RC0603]
R84  4k7  [RC0603]
R85  100k  [RC0603]
R87  33k  [RC0603]
R105  100k  [RC0603]
R107  100k  [RC0603]
R109  100k  [RC0603]
R114  33k  [RC0603]
R116  10k  [RC0603]
R120  100E  [RC0603]
TP8  TESTPOINT1  [TESTPOINT1]  (value not drawn)
VD17  BAT54S  [SOT-23(GSD)]
VD21  SMBJ28A  [SMB]
VD22  BAT54A  [SOT-23(123)]
VD23  SK34SMA  [SMA]
VD24  BAT54S  [SOT-23(GSD)]
VD29  BAT54S  [SOT-23(GSD)]
VT13  IRLML6402  [SOT-23(123)]
XP7  MIF2X03PRP  [MIF2X03PRP]
XP13  MIF2X02PRP  [MIF2X02PRP]
XP14  MIF2X02PRP  [MIF2X02PRP]
XP15  MIF2X02PRP  [MIF2X02PRP]

### Ports
ANALOG_INPUT (out), CANH (bidir), CANL (bidir), GPS_ON (in), IGNITION (out), INPUT_0 (out), INPUT_1 (out), RX_GPS (in), TX_GPS (out)

### Nets
+3V3: R84.2(B) VD17.2(K) VD24.2(K) VD29.2(K)
+3V3_MCU: R116.2(B) VT13.2(S)
+VIN: TP8.1 XP13.3 XP14.3
GND: C82.1(A) C86.1(A) C87.1(A) C118.1(A) R76.1(A) R85.1(A) R87.1(A) R114.1(A) VD17.1(A) VD21.1(A) VD24.1(A) VD29.1(A) XP7.4 XP7.6 XP13.1 XP14.1 XP15.1
ANALOG_INPUT: C82.2(B) R76.2(B) R107.2(B) VD17.3(AK) ; port ANALOG_INPUT
INPUT_0: C86.2(B) R85.2(B) VD22.2(K) ; port INPUT_0
INPUT_1: C87.2(B) R87.2(B) R105.2(B) VD24.3(AK) ; port INPUT_1
RX_GPS: R120.2(B) ; port RX_GPS
TX_GPS: XP15.2 ; port TX_GPS
NetC118_2: C118.2(B) R109.2(B) R114.2(B) VD29.3(AK) ; port IGNITION
NetFU1_2: XP13.2 XP14.2 ; port CANL
NetFU2_2: XP13.4 XP14.4 ; port CANH
NetM1_56: R116.1(A) VT13.1(G) ; port GPS_ON
NetR84_1: R84.1(A) VD22.3(A)
NetR105_1: R105.1(A) XP7.2
NetR107_1: R107.1(A) XP7.3
NetR109_1: R109.1(A) XP7.5
NetR120_1: R120.1(A) XP15.4
NetVD21_2: VD21.2(K) VD22.1(K) XP7.1
NetVD23_1: VD23.1(A) VT13.3(D)
NetVD23_2: VD23.2(K) XP15.3

### Notes on the sheet
- GPS SWITCH
- (in symbol MIF2X02PRP) NET; PIN
- (in symbol MIF2X03PRP) NET; PIN

### Library data of the parts
C82 C86 C87 C118 = CC0603: Value: 0.1uF
R76 R84 R85 R87 R105 R107 R109 R114 R116 R120 = RC0603
  R76: Value: 12k
  R84: Value: 4k7
  R85 R105 R107 R109: Value: 100k
  R87 R114: Value: 33k
  R116: Value: 10k
  R120: Value: 100E
VD17 VD24 VD29 = BAT54S: as VD1 on sheet [4]-MCU_POWER; Value: *
VD21 = SMBJ: Value: SMBJ28A
VD22 = BAT54A: 1.0 Ampere General Purpose Rectifier; ComponentField6: Published 8-Jun-2000, Modified 11-July-2000: SIM Model Added.; Value: *
VD23 = SK34SMA: Schottky Rectifier; Value: {Value}
VT13 = IRLML6402: as VT1 on sheet [7]-H3_POWER; Value: IRLML6402
TP8 = TESTPOINT1: Value: *
XP7 = MIF2X03PRP: Value: *
XP13-XP15 = MIF2X02PRP: Value: *